# EasyEDA Pro project IronBen_扩展板.epro

# Schematic Schematic3
Board Name: 三代; Create Date: 2025-01-12; Page Name: P1; Project Name: 笨笨; Schematic Name: Schematic3; Update Date: 2025-06-20; Company: 嘉立创EDA; Page Size: A4; Version: V1.0
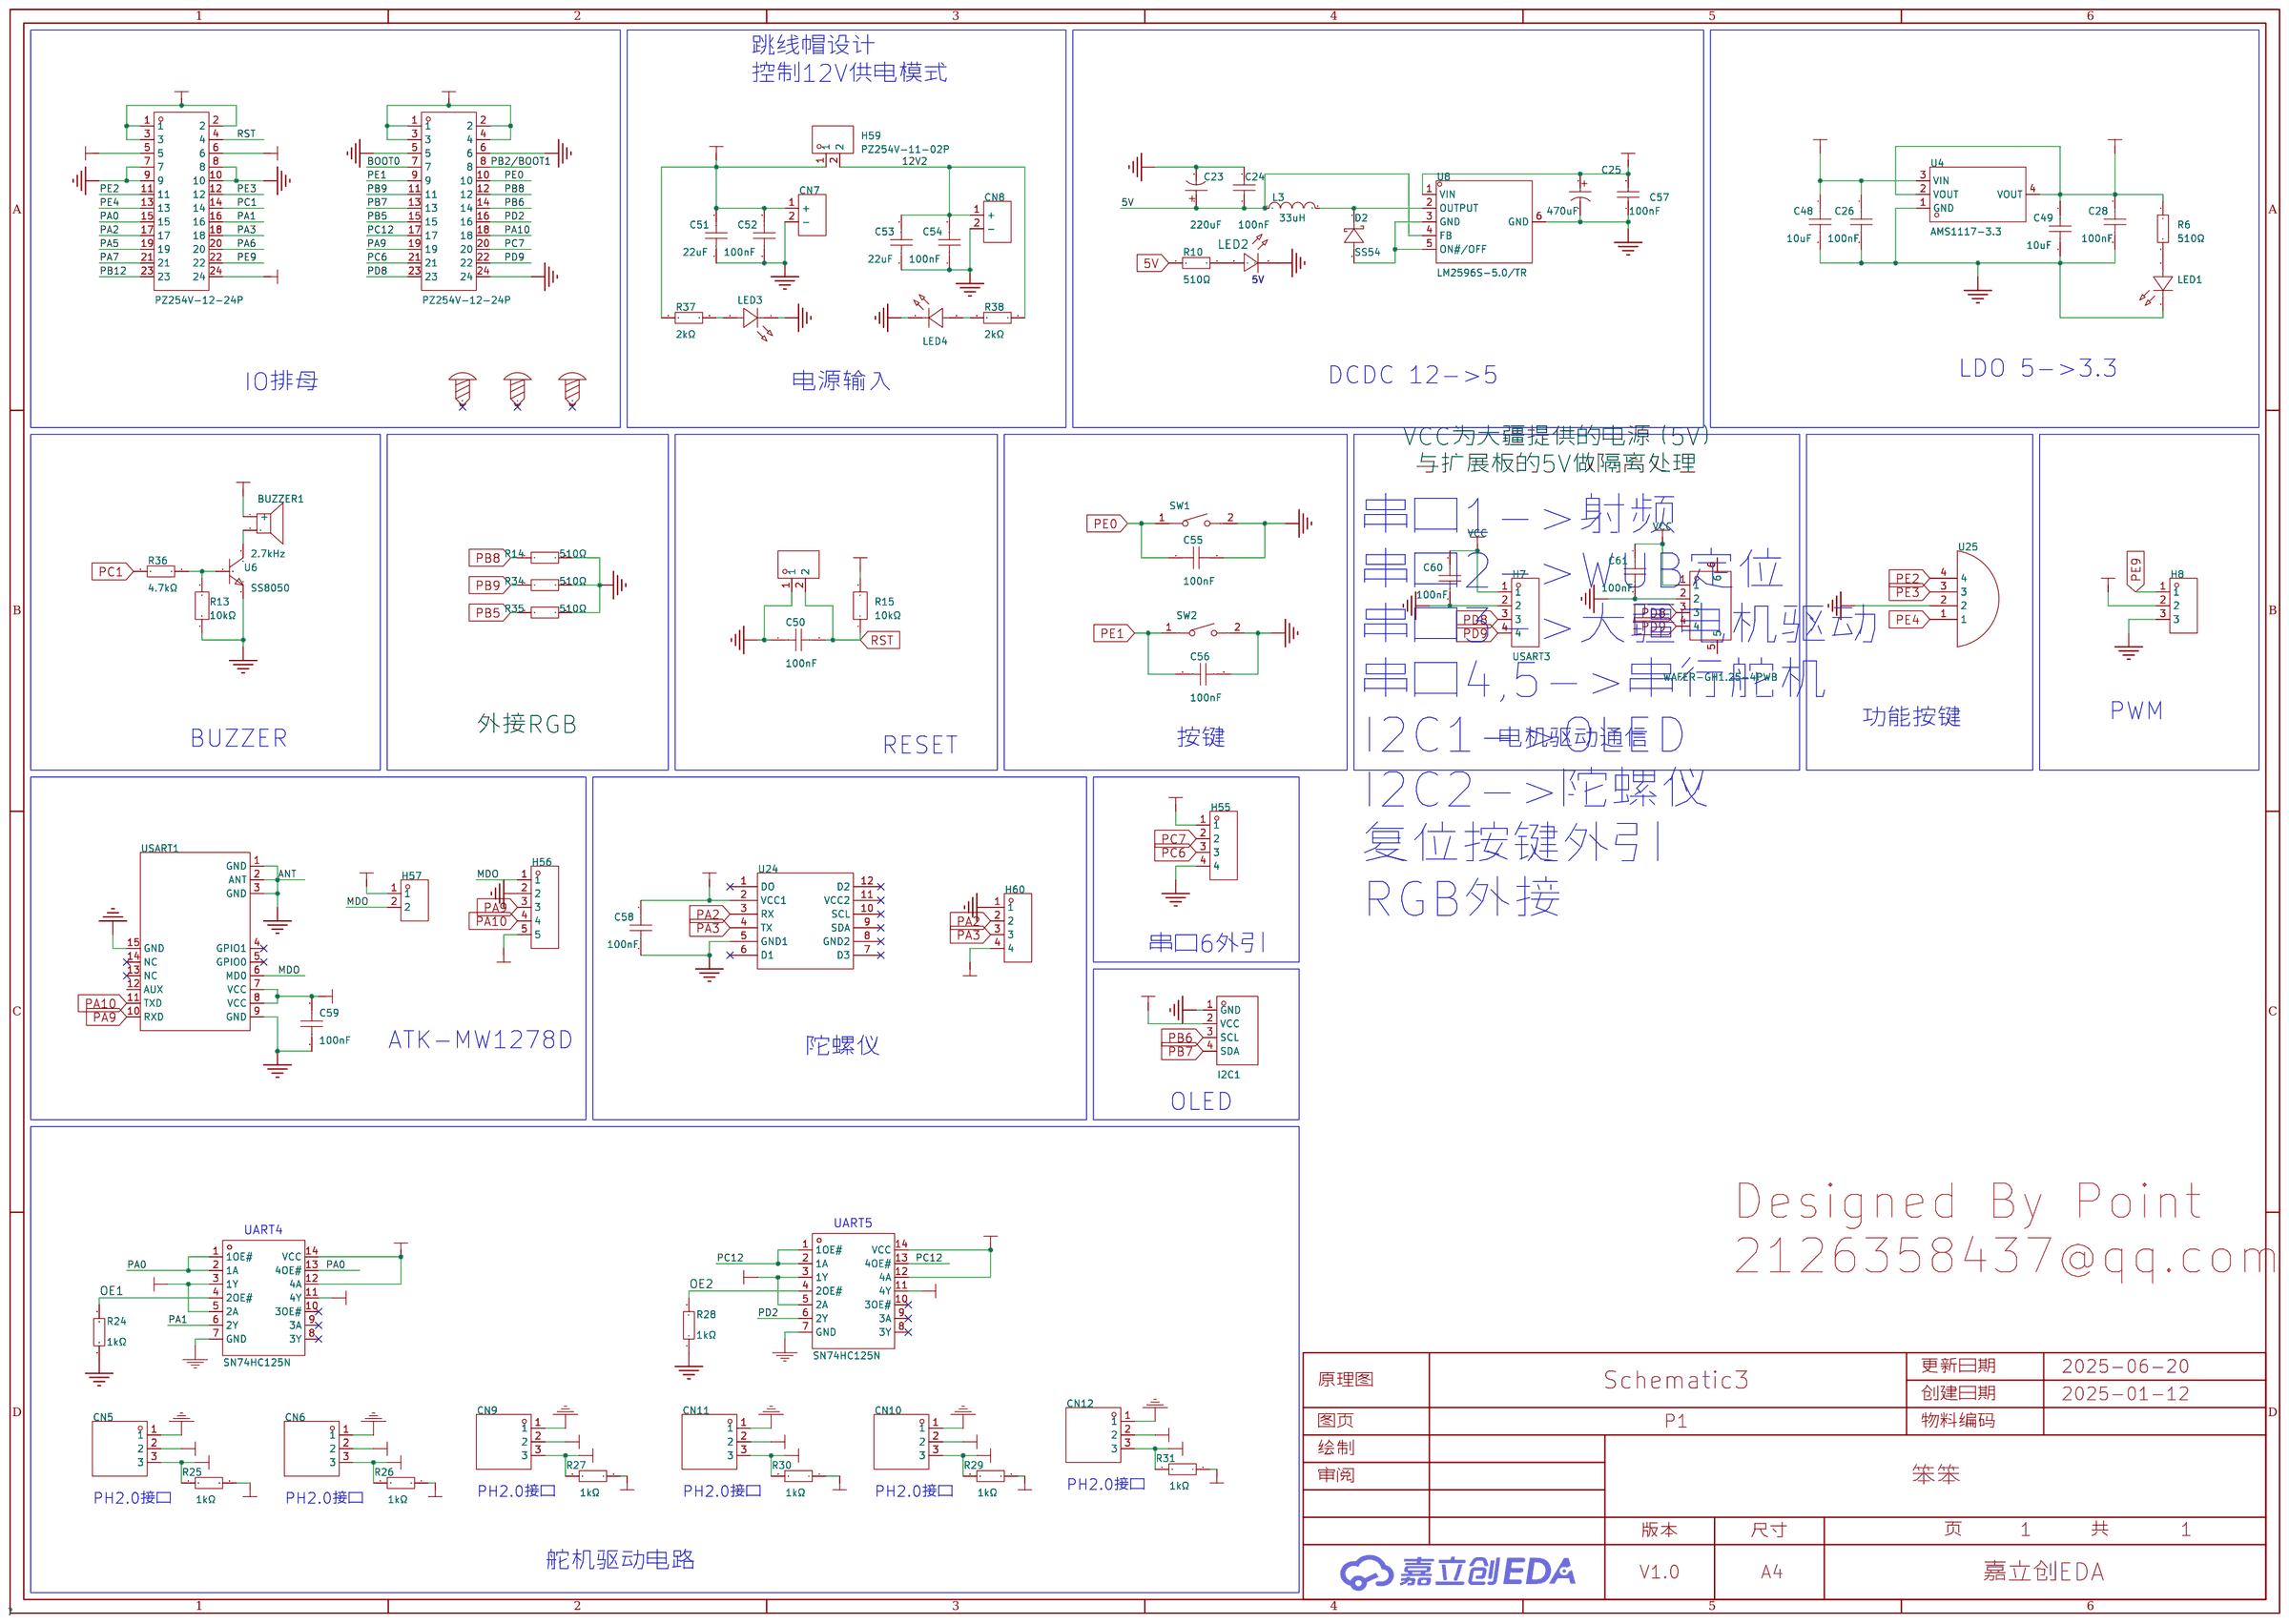
[diagram p0: schematic sheet]

## Parts
BUZZER1  2.7kHz  [BUZ-TH_BD12.0-P7.60-D0.6-FD]
C23  220uF  [CAP-SMD_BD6.3-L6.6-W6.6-FD]
C24  100nF  [C0805]
C25  470uF  [CAP-SMD_BD8.0-L8.3-W8.3-FD]
C26  100nF  [C0603]
C28  100nF  [C0603]
C48  10uF  [C0603]
C49  10uF  [C0603]
C50  100nF  [C0603]
C51  22uF  [C0603]
C52  100nF  [C0603]
C53  22uF  [C0603]
C54  100nF  [C0603]
C55  100nF  [C0603]
C56  100nF  [C0603]
C57  100nF  [C0805]
C58  100nF  [C0603]
C59  100nF  [C0603]
C60  100nF  [C0603]
C61  100nF  [C0603]
CN5  B03B-PASK-1(LF)(SN)  [conn-th_b03b-pask-1-lf-sn-1]
CN6  B03B-PASK-1(LF)(SN)  [conn-th_b03b-pask-1-lf-sn-1]
CN7  XT30UPB-F30.G.Y  [CONN-TH_XT30UPB-F]
CN8  XT30UPB-F30.G.Y  [CONN-TH_XT30UPB-F]
CN9  B03B-PASK-1(LF)(SN)  [conn-th_b03b-pask-1-lf-sn-1]
CN10  B03B-PASK-1(LF)(SN)  [conn-th_b03b-pask-1-lf-sn-1]
CN11  B03B-PASK-1(LF)(SN)  [conn-th_b03b-pask-1-lf-sn-1]
CN12  B03B-PASK-1(LF)(SN)  [conn-th_b03b-pask-1-lf-sn-1]
D2  SS54  [SMA_L4.3-W2.6-LS5.0-RD]
H6  PZ254V-12-24P  [HDR-TH_24P-P2.54-V-M-R2-C12-S2.54]
H7  USART3  [HDR-TH_4P-P2.54-V-M]
H8  PZ254V-11-03P  [HDR-TH_3P-P2.54-V-M]
H55  HC-PZ254-11.5L-1x4PZ  [HDR-TH_4P-P2.54-V-M]
H56  KH-2.54PH180-1X5P-L11.5  [HDR-TH_5P-P2.54-V-M]
H57  PZ254V-11-02P  [HDR-TH_2P-P2.54-V-M]
H58  PZ254V-12-24P  [HDR-TH_24P-P2.54-V-M-R2-C12-S2.54]
H59  PZ254V-11-02P  [HDR-TH_2P-P2.54-V-M]
H60  PZ254V-11-04P  [HDR-TH_4P-P2.54-V-M]
H62  HC-PZ254-13.8L-1x2PWA  [HDR-TH_2P-P2.54-V-M-1]
L3  33uH  [IND-SMD_L12.0-W12.0]
LED1  XL-1608SURC-06  [LED0603-RD_RED]
LED2  -  [LED_0603]
LED3  XL-1608SURC-06  [LED0603-RD_RED]
LED4  XL-1608SURC-06  [LED0603-RD_RED]
R6  510Ω  [R0603]
R10  510Ω  [R0603]
R13  10kΩ  [R0603]
R14  510Ω  [R0603]
R15  10kΩ  [R0603]
R24  1kΩ  [R0603]
R25  1kΩ  [R0603]
R26  1kΩ  [R0603]
R27  1kΩ  [R0603]
R28  1kΩ  [R0603]
R29  1kΩ  [R0603]
R30  1kΩ  [R0603]
R31  1kΩ  [R0603]
R34  510Ω  [R0603]
R35  510Ω  [R0603]
R36  4.7kΩ  [R0603]
R37  2kΩ  [R0603]
R38  2kΩ  [R0603]
SCREW1  -  [M3螺丝]
SCREW3  -  [M3螺丝]
SCREW4  -  [M3螺丝]
SW1  TS-1088-AR02016  [SW-SMD_L3.9-W3.0-P4.45]
SW2  TS-1088-AR02016  [SW-SMD_L3.9-W3.0-P4.45]
U4  AMS1117-3.3  [SOT-223-3_L6.5-W3.4-P2.30-LS7.0-BR]
U6  SS8050  [SOT-23-3_L2.9-W1.3-P1.90-LS2.4-BR]
U8  LM2596S-5.0/TR  [TO-263-5_L10.2-W8.6-P1.70-LS14.4-TL]
U19  SN74HC125N  [PDIP-14_L19.3-W6.4-P2.54-LS7.6-BL]
U20  I2C1  [OLED-TH_L27.8-W27.2-P2.54_C9900033791]
U21  SN74HC125N  [PDIP-14_L19.3-W6.4-P2.54-LS7.6-BL]
U24  -  [JY901s]
U25  -  [四PinU型按键]
U27  WAFER-GH1.25-4PWB  [CONN-SMD_4P-P1.25_XUNPU_WAFER-GH1.25-4PWB]
USART1  -  [atk-lora]

## Library data of the parts
BUZZER1 = TMB12A05_C96093: 驱动方式:有源(内含驱动线路);构造类型:电磁式;频率:2.7kHz;声压(SPL):85dB;; LCSC Part Name: TMB12A05; Supplier Part: C96093; Manufacturer: 华能; Manufacturer Part: TMB12A05; Supplier Footprint: 插件,D=12mm; JLCPCB Part Class: 扩展库; Datasheet: https://atta.szlcsc.com/upload/public/pdf/source/20230426/A4FC10532558AA232D532AB83455FBA4.pdf; Supplier: LCSC; Oscillator Circuit: 有源(内含驱动线路); Technology Type: 电磁式; Operating Voltage: 4V~8V; Sound Pressure Level (SPL): 85dB; Diameter (φD): 12mm; Height: 9.8mm
C23 = VT1C221M0607: 容值:220uF;精度:±20%;额定电压:16V;纹波电流:110mA@120Hz;等效串联电阻:-;; LCSC Part Name: 220uF ±20% 16V; Supplier Part: C90274; Manufacturer: ROQANG(容强); Supplier Footprint: SMD,D6.3xL7.7mm; JLCPCB Part Class: Extended Part; Datasheet: https://atta.szlcsc.com/upload/public/pdf/source/20161207/1481104186053.pdf; Supplier: LCSC; Tolerance: ±20%; Rated Voltage: 16V; Ripple Current: 110mA@120Hz; φD: 6.3mm; L: 7.7mm; Lifetime @ Temp: 2000hrs@105℃; Operating Temperature: -40℃~+105℃
C24 C57 = CL21B104KBCNNNC: 容值:100nF;精度:±10%;额定电压:50V;材质(温度系数):X7R;; LCSC Part Name: 100nF ±10% 50V; Supplier Part: C1711; Manufacturer: SAMSUNG(三星); Supplier Footprint: 0805; JLCPCB Part Class: Extended Part; Datasheet: https://atta.szlcsc.com/upload/public/pdf/source/20160218/1457707763339.pdf; Supplier: LCSC; Tolerance: ±10%; Voltage Rated: 50V; Temperature Coefficient: X7R
C25 = RVE1C471M0810_C107396: 容值:470uF;精度:±20%;额定电压:16V;纹波电流:450mA@120Hz;等效串联电阻:430mΩ;; LCSC Part Name: 470uF ±20% 16V; Supplier Part: C107396; Manufacturer: ROQANG(容强); Manufacturer Part: RVE1C471M0810; Supplier Footprint: SMD,D8xL10.2mm; JLCPCB Part Class: Extended Part; Datasheet: https://atta.szlcsc.com/upload/public/pdf/source/20180326/C107396_C6FCF70791E640AE09F0B90B652FE7BA.pdf; Supplier: LCSC; Tolerance: ±20%; Rated Voltage: 16V; Ripple Current: 450mA@120Hz; Equivalent Series Resistance(ESR): 430mΩ; φD: 8mm; L: 10.2mm; Lifetime @ Temp: 2000hrs@105℃; Operating Temperature: -55℃~+105℃
C26 C28 C55 C56 C58-C61 = CC0603KRX7R9BB104: 容值:100nF;精度:±10%;额定电压:50V;材质(温度系数):X7R;; LCSC Part Name: 100nF ±10% 50V; Supplier Part: C14663; Manufacturer: YAGEO(国巨); Supplier Footprint: 0603; JLCPCB Part Class: 基础库; Datasheet: https://atta.szlcsc.com/upload/public/pdf/source/20180910/C282072_33301C7F631E79921B82A8DAC6BCC5B3.pdf; Supplier: LCSC; Tolerance: ±10%; Voltage Rated: 50V; Temperature Coefficient: X7R
C48 C49 = CL10A106MA8NRNC: 容值:10uF;精度:±20%;额定电压:25V;材质(温度系数):X5R;; LCSC Part Name: 10uF ±20% 25V; Supplier Part: C96446; Manufacturer: SAMSUNG(三星); Supplier Footprint: 0603; JLCPCB Part Class: 基础库; Datasheet: https://atta.szlcsc.com/upload/public/pdf/source/20160218/1457707763339.pdf; Supplier: LCSC; Tolerance: ±20%; Voltage Rated: 25V; Temperature Coefficient: X5R
C50 C52 C54 = CGA0603X7R104K500JT: 容值:100nF;精度:±10%;额定电压:50V;材质(温度系数):X7R;; LCSC Part Name: 100nF ±10% 50V; Supplier Part: C6119867; Manufacturer: HRE(芯声); Supplier Footprint: 0603; JLCPCB Part Class: 扩展库; Supplier: LCSC; Tolerance: ±10%; Voltage Rated: 50V; Temperature Coefficient: X7R
C51 C53 = CGA0603X5R226M160JT: 容值:22uF;精度:±20%;额定电压:16V;材质(温度系数):X5R;; LCSC Part Name: 22uF ±20% 16V; Supplier Part: C6119868; Manufacturer: HRE(芯声); Supplier Footprint: 0603; JLCPCB Part Class: 扩展库; Supplier: LCSC; Tolerance: ±20%; Voltage Rated: 16V; Temperature Coefficient: X5R
CN5 CN6 CN9-CN12 = B03B-PASK-1(LF)(SN): 插针结构:1x3P;间距:2mm;安装方式:直插;参考系列:PA;总PIN数:3P;排数:1;每排PIN数:3;行距:-;额定电流:3A;触头材质:铜合金;触头镀层:锡;工作温度范围:-25℃~+85℃;; LCSC Part Name: 1x3P 间距:2mm 直插 系列:PA; Supplier Part: C160286; Manufacturer: JST; Supplier Footprint: 插件,P=2mm; JLCPCB Part Class: 扩展库; Datasheet: https://atta.szlcsc.com/upload/public/pdf/source/20181010/C265381_3D09E8EDBF5E2CA99C28909F72BE4C43.pdf; Supplier: LCSC; Pins Structure: 1x3P; Pitch: 2mm; Mounting Style: 直插; Reference Series: PA; Number of Pins: 3P; Number of Rows: 1; Number of PINs Per Row: 3; Current Rating (Max): 3A; Contact Material: 铜合金; Contact Plating: 锡; Operating Temperature Range: -25℃~+85℃
CN7 CN8 = XT30UPB-F30.G.Y: 类别:-;类型1:-;; LCSC Part Name: AMASS(艾迈斯)直立焊板式连接器XT30UPB30-F.G.*; Supplier Part: C108769; Manufacturer: AMASS(艾迈斯); JLCPCB Part Class: 扩展库; Datasheet: https://atta.szlcsc.com/upload/public/pdf/source/20220715/AFD68B9E8B6CA95A7295DBF4AF9325E4.pdf; Supplier: LCSC; Brand: 艾迈斯; Type: 航模插头; Colour: 黄色; RatedVoltage: DC 500V; InterfaceType: 母头; MetalMaterial: 镀金; InsulationMaterial: PA; RatedCurrent: 15A; contact resistance: 0.65mΩ
D2 = SS54_C727065: 二极管配置:独立式;正向压降(Vf):550mV@5A;直流反向耐压(Vr):40V;平均整流电流(Io):5A;; LCSC Part Name: 电压:40V 电流:5A; Supplier Part: C727065; Manufacturer: TWGMC(台湾迪嘉); Supplier Footprint: SMA(DO-214AC); JLCPCB Part Class: 扩展库; Datasheet: https://atta.szlcsc.com/upload/public/pdf/source/20200828/C727064_BD0A2B36CBC76CEA4B6710C57718D41F.pdf; Supplier: LCSC; Diode Configuration: 独立式; Forward Voltage (Vf@If): 550mV@5A; Reverse Voltage (Vr): 40V; Average Rectified Current (Io): 5A; Reverse Leakage Current (Ir): 500uA@40V
H6 H58 = PZ254V-12-24P: 插针结构:2x12P;间距:2.54mm;行距:2.54mm;圆针/方针:方针;安装类型:直插;排数:双排;总PIN位数:24P;额定电流:-;额定电压:-;配合针长度:6mm;塑高:2.5mm;端接针长度:3mm;触头材质:黄铜;触头镀层:-;工作温度范围:-40℃~+105℃;颜色:黑色;; LCSC Part Name: 间距:2.54mm 2x12P 直插 方针; Supplier Part: C492429; Manufacturer: XFCN(兴飞); Supplier Footprint: 插件,P=2.54mm; JLCPCB Part Class: 扩展库; Datasheet: https://atta.szlcsc.com/upload/public/pdf/source/20200309/C492429_A90DEF30FD4D9CDC2C3DDFC5EAF9C00B.pdf; Supplier: LCSC; Pin Structure: 2x12P; Pitch: 2.54mm; Row Spacing: 2.54mm; Circluar Pins/Square Pins: 方针; Mounting Type: 直插; Number of Rows: 双排; Number of Pins: 24P; Length of Mating Pin: 6mm; Insulation Height: 2.5mm; Length of End Connection Pin: 3mm; Contact Material: 黄铜; Operating Temperature Range: -40℃~+105℃; Color: 黑色
H7 H60 = PZ254V-11-04P: 插针结构:1x4P;间距:2.54mm;行距:-;圆针/方针:方针;安装类型:直插;排数:单排;总PIN位数:4P;额定电流:3A;额定电压:250V;配合针长度:6mm;塑高:2.5mm;端接针长度:3mm;触头材质:-;工作温度范围:-40℃~+105℃;颜色:黑色;; LCSC Part Name: 间距:2.54mm 1x4P 直插 方针; Supplier Part: C2691448; Manufacturer: XFCN(兴飞); Supplier Footprint: 插件,P=2.54mm; JLCPCB Part Class: 扩展库; Datasheet: https://atta.szlcsc.com/upload/public/pdf/source/20200309/C492403_F9F19131791D08044AD4F84F8E751A34.pdf; Supplier: LCSC; Pin Structure: 1x4P; Pitch: 2.54mm; Circluar Pins/Square Pins: 方针; Mounting Type: 直插; Number of Rows: 单排; Number of Pins: 4P; Current Rating (Max): 3A; Voltage Rating (Max): 250V; Length of Mating Pin: 6mm; Insulation Height: 2.5mm; Length of End Connection Pin: 3mm; Operating Temperature Range: -40℃~+105℃; Color: 黑色
H8 = PZ254V-11-03P: 插针结构:1x3P;间距:2.54mm;行距:-;圆针/方针:方针;安装类型:直插;排数:单排;总PIN位数:3P;额定电流:3A;额定电压:250V;配合针长度:6mm;塑高:2.5mm;端接针长度:3mm;工作温度范围:-40℃~+105℃;颜色:黑色;; LCSC Part Name: 间距:2.54mm 1x3P 直插 方针; Supplier Part: C2937625; Manufacturer: XFCN(兴飞); Supplier Footprint: 插件,P=2.54mm; JLCPCB Part Class: 扩展库; Datasheet: https://atta.szlcsc.com/upload/public/pdf/source/20200309/C492402_8335C3D49C4E4C618838D59BB1D024C1.pdf; Supplier: LCSC; Pin Structure: 1x3P; Pitch: 2.54mm; Circluar Pins/Square Pins: 方针; Mounting Type: 直插; Number of Rows: 单排; Number of Pins: 3P; Current Rating (Max): 3A; Voltage Rating (Max): 250V; Length of Mating Pin: 6mm; Insulation Height: 2.5mm; Length of End Connection Pin: 3mm; Operating Temperature Range: -40℃~+105℃; Color: 黑色
H55 = HC-PZ254-11.5L-1x4PZ: 插针结构:1x4P;间距:2.54mm;行距:-;圆针/方针:方针;安装类型:直插;排数:单排;总PIN位数:4P;额定电流:3A;配合针长度:6mm;塑高:2.5mm;端接针长度:3mm;触头材质:黄铜;触头镀层:金;工作温度范围:-40℃~+105℃;焊接温度(最大值):260℃;颜色:黑色;; LCSC Part Name: 间距2.54mm 1x4Pin 直插 H2.5 L11.5; Supplier Part: C27985189; Manufacturer: HC(虹成电子); Supplier Footprint: 插件,P=2.54mm; JLCPCB Part Class: 扩展库; Datasheet: https://atta.szlcsc.com/upload/public/pdf/source/20240710/CB85400293F297620DD48460C85CEAB6.pdf; Supplier: LCSC; Pin Structure: 1x4P; Pitch: 2.54mm; Circluar Pins/Square Pins: 方针; Mounting Type: 直插; Number of Rows: 单排; Number of Pins: 4P; Current Rating (Max): 3A; Length of Mating Pin: 6mm; Insulation Height: 2.5mm; Length of End Connection Pin: 3mm; Contact Material: 黄铜; Contact Plating: 金; Operating Temperature Range: -40℃~+105℃; Soldering Temperature(Max): 260℃; Color: 黑色
H56 = KH-2.54PH180-1X5P-L11.5: 插针结构:1x5P;间距:2.54mm;行距:-;圆针/方针:方针;安装类型:直插;排数:单排;总PIN位数:5P;额定电流:3A;额定电压:-;配合针长度:6mm;塑高:2.5mm;端接针长度:3mm;工作温度范围:-40℃~+105℃;颜色:黑色;; LCSC Part Name: 间距:2.54mm 1x5P 直插 方针; Supplier Part: C2932699; Manufacturer: kinghelm(金航标); Supplier Footprint: 插件,P=2.54mm; JLCPCB Part Class: 扩展库; Datasheet: https://atta.szlcsc.com/upload/public/pdf/source/20211220/226CF9663F50C56A6910C5061F0E2217.pdf; Supplier: LCSC; Pin Structure: 1x5P; Pitch: 2.54mm; Circluar Pins/Square Pins: 方针; Mounting Type: 直插; Number of Rows: 单排; Number of Pins: 5P; Current Rating (Max): 3A; Length of Mating Pin: 6mm; Insulation Height: 2.5mm; Length of End Connection Pin: 3mm; Operating Temperature Range: -40℃~+105℃; Color: 黑色
H57 H59 = PZ254V-11-02P: 插针结构:1x2P;间距:2.54mm;行距:-;圆针/方针:方针;安装类型:直插;排数:单排;总PIN位数:2P;额定电流:-;额定电压:-;配合针长度:6mm;塑高:2.5mm;端接针长度:3mm;触头材质:黄铜;触头镀层:-;工作温度范围:-40℃~+105℃;颜色:黑色;; LCSC Part Name: 间距:2.54mm 1x2P 直插 方针; Supplier Part: C492401; Manufacturer: XFCN(兴飞); Supplier Footprint: 插件,P=2.54mm; JLCPCB Part Class: 扩展库; Datasheet: https://atta.szlcsc.com/upload/public/pdf/source/20200309/C492401_A812433581A9B211A7FFA413ADDFF0E5.pdf; Supplier: LCSC; Pin Structure: 1x2P; Pitch: 2.54mm; Circluar Pins/Square Pins: 方针; Mounting Type: 直插; Number of Rows: 单排; Number of Pins: 2P; Length of Mating Pin: 6mm; Insulation Height: 2.5mm; Length of End Connection Pin: 3mm; Contact Material: 黄铜; Operating Temperature Range: -40℃~+105℃; Color: 黑色
H62 = HC-PZ254-13.8L-1x2PWA: 插针结构:1x2P;间距:2.54mm;行距:-;圆针/方针:方针;排数:单排;总PIN位数:2P;额定电流:3A;额定电压:-;配合针长度:6mm;塑高:2.5mm;端接针长度:3mm;触头材质:黄铜;触头镀层:金;工作温度:-40℃~+105℃;颜色:黑色;; LCSC Part Name: 间距2.54mm 1x2Pin 弯插 PC3.0 PA6.0 PB4.3 L13.8 弯凹面; Supplier Part: C27985201; Manufacturer: HC(虹成电子); Supplier Footprint: 弯插,P=2.54mm; JLCPCB Part Class: 扩展库; Datasheet: https://atta.szlcsc.com/upload/public/pdf/source/20250106/2CC12058963FF98249E2E6FA65E04B96.pdf; Supplier: LCSC; Pin Structure: 1x2P; Pitch: 2.54mm; Circluar Pins/Square Pins: 方针; Number of Rows: 单排; Number of Pins: 2P; Current Rating: 3A; Length of Mating Pin: 6mm; Insulation Height: 2.5mm; Length of End Connection Pin: 3mm; Contact Material: 黄铜; Contact Plating: 金; Operating Temperature: -40℃~+105℃; Color: 黑色
L3 = SLH1207S330MTT: 电感值:33uH;精度:±20%;额定电流:3A;; LCSC Part Name: 33uH ±20%; Supplier Part: C181844; Manufacturer: Sunltech(韩国顺磁); Supplier Footprint: SMD; JLCPCB Part Class: Extended Part; Datasheet: https://atta.szlcsc.com/upload/public/pdf/source/20180509/C216200_948378E1D3CCC25B70CFE5927CB2C576.pdf; Supplier: LCSC; Tolerance: ±20%; Rated Current: 3A; DC Resistance (DCR): 64.8mΩ
LED1 LED3 LED4 = XL-1608SURC-06: 发光颜色:红色;功率:55mW;正向电流:25mA;主波长:617nm~621nm;透镜颜色:无色透明透镜;色温:-;发光角度:120°;载带方式:正贴;工作温度:-30℃~+85℃;; Supplier Part: C965799; Manufacturer: XINGLIGHT(成兴光); Supplier Footprint: 0603; JLCPCB Part Class: 扩展库; Datasheet: https://atta.szlcsc.com/upload/public/pdf/source/20221102/D860AFDD1CDB02C5A8064103A32707E2.pdf; Supplier: LCSC; Emitted Color: 红色; Power Dissipation: 55mW; Forward Current: 25mA; Dominant Wavelength: 617nm~621nm; Peak Wavelength: 623nm; Lens Color: 无色透明透镜; Viewing Angle: 120°; Mounting Sytle: 正贴; Operating Temperature: -30℃~+85℃
LED2 = LED_0603-R: 5V; Supplier Footprint: 0603
R6 R10 R14 R34 R35 = 0603WAF5100T5E: 电阻类型:厚膜电阻;阻值:510Ω;精度:±1%;功率:100mW;最大工作电压:75V;温度系数:±100ppm/℃;; LCSC Part Name: 510Ω ±1% 100mW 厚膜电阻; Supplier Part: C23193; Manufacturer: UNI-ROYAL(厚声); Supplier Footprint: 0603; JLCPCB Part Class: 基础库; Datasheet: https://atta.szlcsc.com/upload/public/pdf/source/20200306/C422600_1E6D84923E4A46A82E41ADD87F860B5C.pdf; Supplier: LCSC; Type: 厚膜电阻; Tolerance: ±1%; Power(Watts): 100mW; Overload Voltage (Max): 75V; Temperature Coefficient: ±100ppm/℃; Operating Temperature Range: -55℃~+155℃
R13 R15 = FRC0603J103TS: 电阻类型:厚膜电阻;阻值:10kΩ;精度:±5%;功率:100mW;最大工作电压:75V;温度系数:±100ppm/℃;; LCSC Part Name: 10kΩ ±5% 100mW 厚膜电阻; Supplier Part: C2930027; Manufacturer: FOJAN(富捷); Supplier Footprint: 0603; JLCPCB Part Class: 扩展库; Datasheet: https://atta.szlcsc.com/upload/public/pdf/source/20211221/925EC7D7225764EE0046F22065062C87.pdf; Supplier: LCSC; Type: 厚膜电阻; Tolerance: ±5%; Power(Watts): 100mW; Overload Voltage (Max): 75V; Temperature Coefficient: ±100ppm/℃; Operating Temperature Range: -55℃~+155℃
R24-R31 = RC0603FR-071KL: 电阻类型:厚膜电阻;阻值:1kΩ;精度:±1%;功率:100mW;最大工作电压:75V;温度系数:±100ppm/℃;; LCSC Part Name: 厚膜电阻 1kΩ ±1% 100mW; Supplier Part: C22548; Manufacturer: YAGEO(国巨); Supplier Footprint: 0603; JLCPCB Part Class: 扩展库; Datasheet: https://atta.szlcsc.com/upload/public/pdf/source/20180316/70C0E2BDAE7FCC62C531A5A58D202EE1.pdf; Supplier: LCSC; Type: 厚膜电阻; Tolerance: ±1%; Power(Watts): 100mW; Overload Voltage (Max): 75V; Temperature Coefficient: ±100ppm/℃; Operating Temperature Range: -55℃~+155℃
R36 = RC0603FR-074K7L: 电阻类型:厚膜电阻;阻值:4.7kΩ;精度:±1%;功率:100mW;最大工作电压:75V;温度系数:±100ppm/℃;; LCSC Part Name: 厚膜电阻 4.7kΩ ±1% 100mW; Supplier Part: C99782; Manufacturer: YAGEO(国巨); Supplier Footprint: 0603; JLCPCB Part Class: 扩展库; Datasheet: https://atta.szlcsc.com/upload/public/pdf/source/20180224/C181757_15194369480721363983.pdf; Supplier: LCSC; Type: 厚膜电阻; Tolerance: ±1%; Power(Watts): 100mW; Overload Voltage (Max): 75V; Temperature Coefficient: ±100ppm/℃; Operating Temperature Range: -55℃~+155℃
R37 R38 = 0603WAF2001T5E: 电阻类型:厚膜电阻;阻值:2kΩ;精度:±1%;功率:100mW;最大工作电压:75V;温度系数:±100ppm/℃;; LCSC Part Name: 2kΩ ±1% 100mW 厚膜电阻; Supplier Part: C22975; Manufacturer: UNI-ROYAL(厚声); Supplier Footprint: 0603; JLCPCB Part Class: 基础库; Datasheet: https://atta.szlcsc.com/upload/public/pdf/source/20200306/C422600_1E6D84923E4A46A82E41ADD87F860B5C.pdf; Supplier: LCSC; Type: 厚膜电阻; Tolerance: ±1%; Power(Watts): 100mW; Overload Voltage (Max): 75V; Temperature Coefficient: ±100ppm/℃; Operating Temperature Range: -55℃~+155℃
SCREW1 SCREW3 SCREW4 = M3螺丝: Supplier Footprint: 插件
SW1 SW2 = TS-1088-AR02016: 电路结构:单刀单掷;按钮形状:圆形按钮;作用力:160gf;安装方式:立贴;开关长度:4mm;开关宽度:3mm;开关高度:2mm;带支架:不带;触点电流:50mA;额定电压(DC):12V;绝缘电阻:100MΩ;机械寿命:10万次;; LCSC Part Name: 4*3*2mm 立贴 轻触开关; Supplier Part: C720477; Manufacturer: XUNPU(讯普); Supplier Footprint: SMD; JLCPCB Part Class: 扩展库; Datasheet: https://atta.szlcsc.com/upload/public/pdf/source/20200810/C720475_60D09DD6C54279ADDB2DC25100F1CC11.pdf; Supplier: LCSC; Circuit: 单刀单掷; Actuator Style: 圆形按钮; Operating Force: 160gf; Mounting Style: 立贴; Switch Length: 4mm; Switch Width: 3mm; Switch Height: 2mm; Strike Gundam: 不带; Contact Current: 50mA; Voltage Rating (DC): 12V; Insulation Resistance: 100MΩ; Actuator/Cap Color: 黑色; Pin Style: SMD接片; Mechanical Life: 10万次; Operating Temperature: -30℃~+80℃
U4 = AMS1117-3.3_C6186: 输出类型:固定;最大输入电压:-;输出电压:3.3V;最大输出电流:1A;电源纹波抑制比(PSRR):72dB@(120Hz);输出极性:正极;; LCSC Part Name: 输出3.3V 1A; Supplier Part: C6186; Manufacturer: AMS; Supplier Footprint: SOT-223; JLCPCB Part Class: 基础库; Datasheet: https://atta.szlcsc.com/upload/public/pdf/source/20180727/C6186_7A095716F0823C02F1997A905E26C086.pdf; Supplier: LCSC; Output Type: 固定; Output Voltage: 3.3V; MAX Output Current: 1A; Power Supply Rejection Ratio (PSRR): 72dB@(120Hz); Dropout Voltage: 1.3V@(800mA); Output Polarity: 正极; Number of Outputs: 1
U6 = SS8050_C7420370: 晶体管类型:NPN;集电极电流(Ic):1.5A;集射极击穿电压(Vceo):25V;功率(Pd):300mW;直流电流增益(hFE@Ic,Vce):120@100mA,1.0V;; LCSC Part Name: 耐压:25V 电流:1.5A NPN H档 200-350; Supplier Part: C7420370; Manufacturer: 宏迦橙; Supplier Footprint: SOT-23; JLCPCB Part Class: 扩展库; Datasheet: https://atta.szlcsc.com/upload/public/pdf/source/20231222/9C4050A7669EB24B3ACD0418218817FD.pdf; Supplier: LCSC; Transistor Type: NPN; Collector Current (Ic): 1.5A; Collector-Emitter Breakdown Voltage (Vceo): 25V; Power Dissipation (Pd): 300mW; DC Current Gain (hFE@Ic,Vce): 120@100mA,1.0V; Transition Frequency (fT): 100MHz; Collector Cut-Off Current (Icbo): 100nA; Collector-Emitter Saturation Voltage (VCE(sat)@Ic,Ib): 500mV@800mA,80mA; Operating Temperature: -55℃~+150℃
U8 = LM2596S-5.0/TR: Supplier Part: C194349; Manufacturer: HGSEMI(华冠); Supplier Footprint: TO-263-5; JLCPCB Part Class: Extended Part; Datasheet: https://atta.szlcsc.com/upload/public/pdf/source/20200924/C194349_32A49216D05BD4A6AA6EE8DE19C810A9.pdf; Supplier: LCSC
U19 U21 = SN74HC125N: 电源电压:2V~6V;元件数:4;每个元件位数:1;灌电流(IOL):7.8mA;拉电流(IOH):7.8mA;; Supplier Part: C2890; Manufacturer: TI(德州仪器); Supplier Footprint: DIP-14; JLCPCB Part Class: 扩展库; Datasheet: https://www.ti.com/cn/lit/gpn/sn74hc125; Supplier: LCSC; output type: 三态; Supply Voltage: 2V~6V; Number of Elements: 4; Number of Bits per Element: 1; Sink Current: 7.8mA; Source Current: 7.8mA; Logic Family: 74HC; Operating Temperature: -40℃~+85℃
U20 = HS96L03W2C03: 主控芯片:SSD1315;接口类型:I2C;尺寸(inch):0.96;像素分辨率:128x64;; LCSC Part Name: 0.96寸OLED显示屏窄白光IIC; Supplier Part: C5248080; Manufacturer: HS(汉昇); JLCPCB Part Class: 扩展库; Datasheet: https://atta.szlcsc.com/upload/public/pdf/source/20230627/763D01F79A90007632F098068C7C8AD9.pdf; Supplier: LCSC; Main Control Chip: SSD1315; Interface Type: I2C; Size: 0.96; Pixel Resolution: 128x64; Operating Temperature: -40℃~+70℃
U24 = JY901S
U25 = 四脚U型按键
U27 = WAFER-GH1.25-4PWB: 插针结构:1x4P;间距:1.25mm;安装方式:卧贴;参考系列:GH;总PIN数:4P;排数:1;每排PIN数:4;行距:-;额定电流:1A;触头材质:黄铜;触头镀层:-;工作温度范围:-25℃~+85℃;; LCSC Part Name: 1x4P 间距:1.25mm 卧贴 系列:GH; Supplier Part: C3029379; Manufacturer: XUNPU(讯普); Supplier Footprint: SMD,P=1.25mm,卧贴; JLCPCB Part Class: 扩展库; Datasheet: https://atta.szlcsc.com/upload/public/pdf/source/20220527/CB8773BFB0913C3B8ABD62CB38BA101A.pdf; Supplier: LCSC; Pins Structure: 1x4P; Pitch: 1.25mm; Mounting Type: 卧贴; Reference Series: GH; Number of Pins: 4P; Number of Rows: 1; Number of PINs Per Row: 4; Current Rating: 1A; Contact Material: 黄铜; Operating Temperature: -25℃~+85℃; Voltage Rating: 125V; Plastic Material: LCP; Supplementary Features: 辅助焊脚; Color: 米色; Z-Height of the Board: 4.35mm; X-Length of Bottom Edge on Board (Spacing Line): 8.25mm; Y-Width of Bottom Edge on Board: 5mm
USART1 = ATK-LORA-02: 正点原子LORA; _: 3

## Nets
3V3: C28.1 C49.1 H6.5 H6.6 H57.1 H58.1 H58.2 H58.3 H58.4 R6.1 R15.2 R25.1 R26.1 R27.1 R29.1 R30.1 R31.1 U4.2(VOUT) U4.4(VOUT) U19.12(4A) U19.14(VCC) U20.2(VCC) U21.12(4A) U21.14(VCC)
5V: BUZZER1.1(+) C23.1 C24.1 C26.1 C48.1 C58.1 C59.1 H6.1 H6.2 H6.3 H6.24 H8.2 H55.1 H56.5 H60.4 L3.1 R10.1 U4.3(VIN) U8.4(FB) U24.2(VCC1) USART1.7(VCC) USART1.8(VCC)
12V1: C25.1 C51.2 C52.2 C57.2 CN5.2 CN6.2 CN7.1(+) CN9.2 H59.1 R37.1 U8.1(VIN)
12V2: C53.2 C54.2 CN8.1(+) CN10.2 CN11.2 CN12.2 H59.2 R38.2
GND: C23.2 C24.2 C25.2 C26.2 C28.2 C48.2 C49.2 C50.1 C51.1 C52.1 C53.1 C54.1 C55.2 C56.2 C57.1 C58.2 C59.2 C60.2 C61.2 CN5.1 CN6.1 CN7.2(-) CN8.2(-) CN9.1 CN10.1 CN11.1 CN12.1 H6.7 H6.8 H6.9 H6.10 H7.2 H8.3 H55.4 H56.2 H58.5 H58.6 H58.24 H60.1 H62.1 LED1.1(K) LED2.1(C) LED3.1(K) LED4.1(K) R13.1 R14.2 R24.1 R28.1 R34.2 R35.2 SW1.2 SW2.2 U4.1(GND) U6.2(E) U8.6(GND) U19.7(GND) U20.1(GND) U21.7(GND) U24.5(GND1) U25.2 U27.2 USART1.1(GND) USART1.3(GND) USART1.9(GND) USART1.15(GND)
VCC: C60.1 C61.1 H7.1 U27.1
ANT: USART1.2(ANT)
BOOT0: H58.7
BUS1: CN5.3 CN6.3 CN9.3 R25.2 R26.2 R27.2 U19.3(1Y) U19.5(2A)
BUS2: CN10.3 CN11.3 CN12.3 R29.2 R30.2 R31.2 U21.3(1Y) U21.5(2A)
MDO: H56.1 H57.2 USART1.6(MD0)
OE1: R24.2 U19.4(2OE#) U19.11(4Y)
OE2: R28.2 U21.4(2OE#) U21.11(4Y)
PA0: H6.15 U19.1(1OE#) U19.2(1A) U19.13(4OE#)
PA1: H6.16 U19.6(2Y)
PA2: H6.17 H60.2 U24.3(RX)
PA3: H6.18 H60.3 U24.4(TX)
PA5: H6.19
PA6: H6.20
PA7: H6.21
PA9: H56.3 H58.19 USART1.10(RXD)
PA10: H56.4 H58.18 USART1.11(TXD)
PB2/BOOT1: H58.8
PB5: H58.15 R35.1
PB6: H58.14 U20.3(SCL)
PB7: H58.13 U20.4(SDA)
PB8: H58.12 R14.1
PB9: H58.11 R34.1
PB12: H6.23
PC1: H6.14 R36.1
PC6: H55.3 H58.21
PC7: H55.2 H58.20
PC12: H58.17 U21.1(1OE#) U21.2(1A) U21.13(4OE#)
PD2: H58.16 U21.6(2Y)
PD8: H7.3 H58.23 U27.3
PD9: H7.4 H58.22 U27.4
PE0: C55.1 H58.10 SW1.1
PE1: C56.1 H58.9 SW2.1
PE2: H6.11 U25.4
PE3: H6.12 U25.3
PE4: H6.13 U25.1
PE9: H6.22 H8.1
RST: C50.2 H6.4 H62.2 R15.1
$1N4130: LED1.2(A) R6.2
$1N4134: R13.2 R36.2 U6.1(B)
$1N4137: BUZZER1.2 U6.3(C)
$1N4153: LED3.2(A) R37.2
$1N4155: LED4.2(A) R38.1
$1N14491: D2.2 U8.3(GND) U8.5(ON#/OFF)
$1N14492: D2.1 L3.2 U8.2(OUTPUT)
$1N14499: LED2.2(A) R10.2

Not connected (* = marked no-connect by the designer): SCREW1 1*; SCREW3 1*; SCREW4 1*; U19 8(3Y)* 9(3A)* 10(3OE#)*; U21 8(3Y)* 9(3A)* 10(3OE#)*; U24 1(DO)* 6(D1)* 7(D3)* 8(GND2)* 9(SDA)* 10(SCL)* 11(VCC2)* 12(D2)*; U27 5 6; USART1 4(GPIO1)* 5(GPIO0)* 12(AUX) 13(NC)* 14(NC)*

## Notes on the sheet
- 跳线帽设计
  控制12V供电模式
- DCDC 12->5
- LDO 5->3.3
- IO排母
- 电源输入
- VCC为大疆提供的电源（5V）
   与扩展板的5V做隔离处理
- 功能按键
- PWM
- 外接RGB
- BUZZER
- RESET
- 按键
- 电机驱动通信
- 串口1->射频
  串口2->WUB定位
  串口3->大疆电机驱动
  串口4,5->串行舵机
  I2C1->OLED
  I2C2->陀螺仪
  复位按键外引
  RGB外接
- 串口6外引
- ATK-MW1278D
- 陀螺仪
- OLED
- UART5
- UART4
- Designed By Point
  2126358437@qq.com
- PH2.0接口
- PH2.0接口
- PH2.0接口
- PH2.0接口
- PH2.0接口
- PH2.0接口
- 舵机驱动电路

# Board PCB7
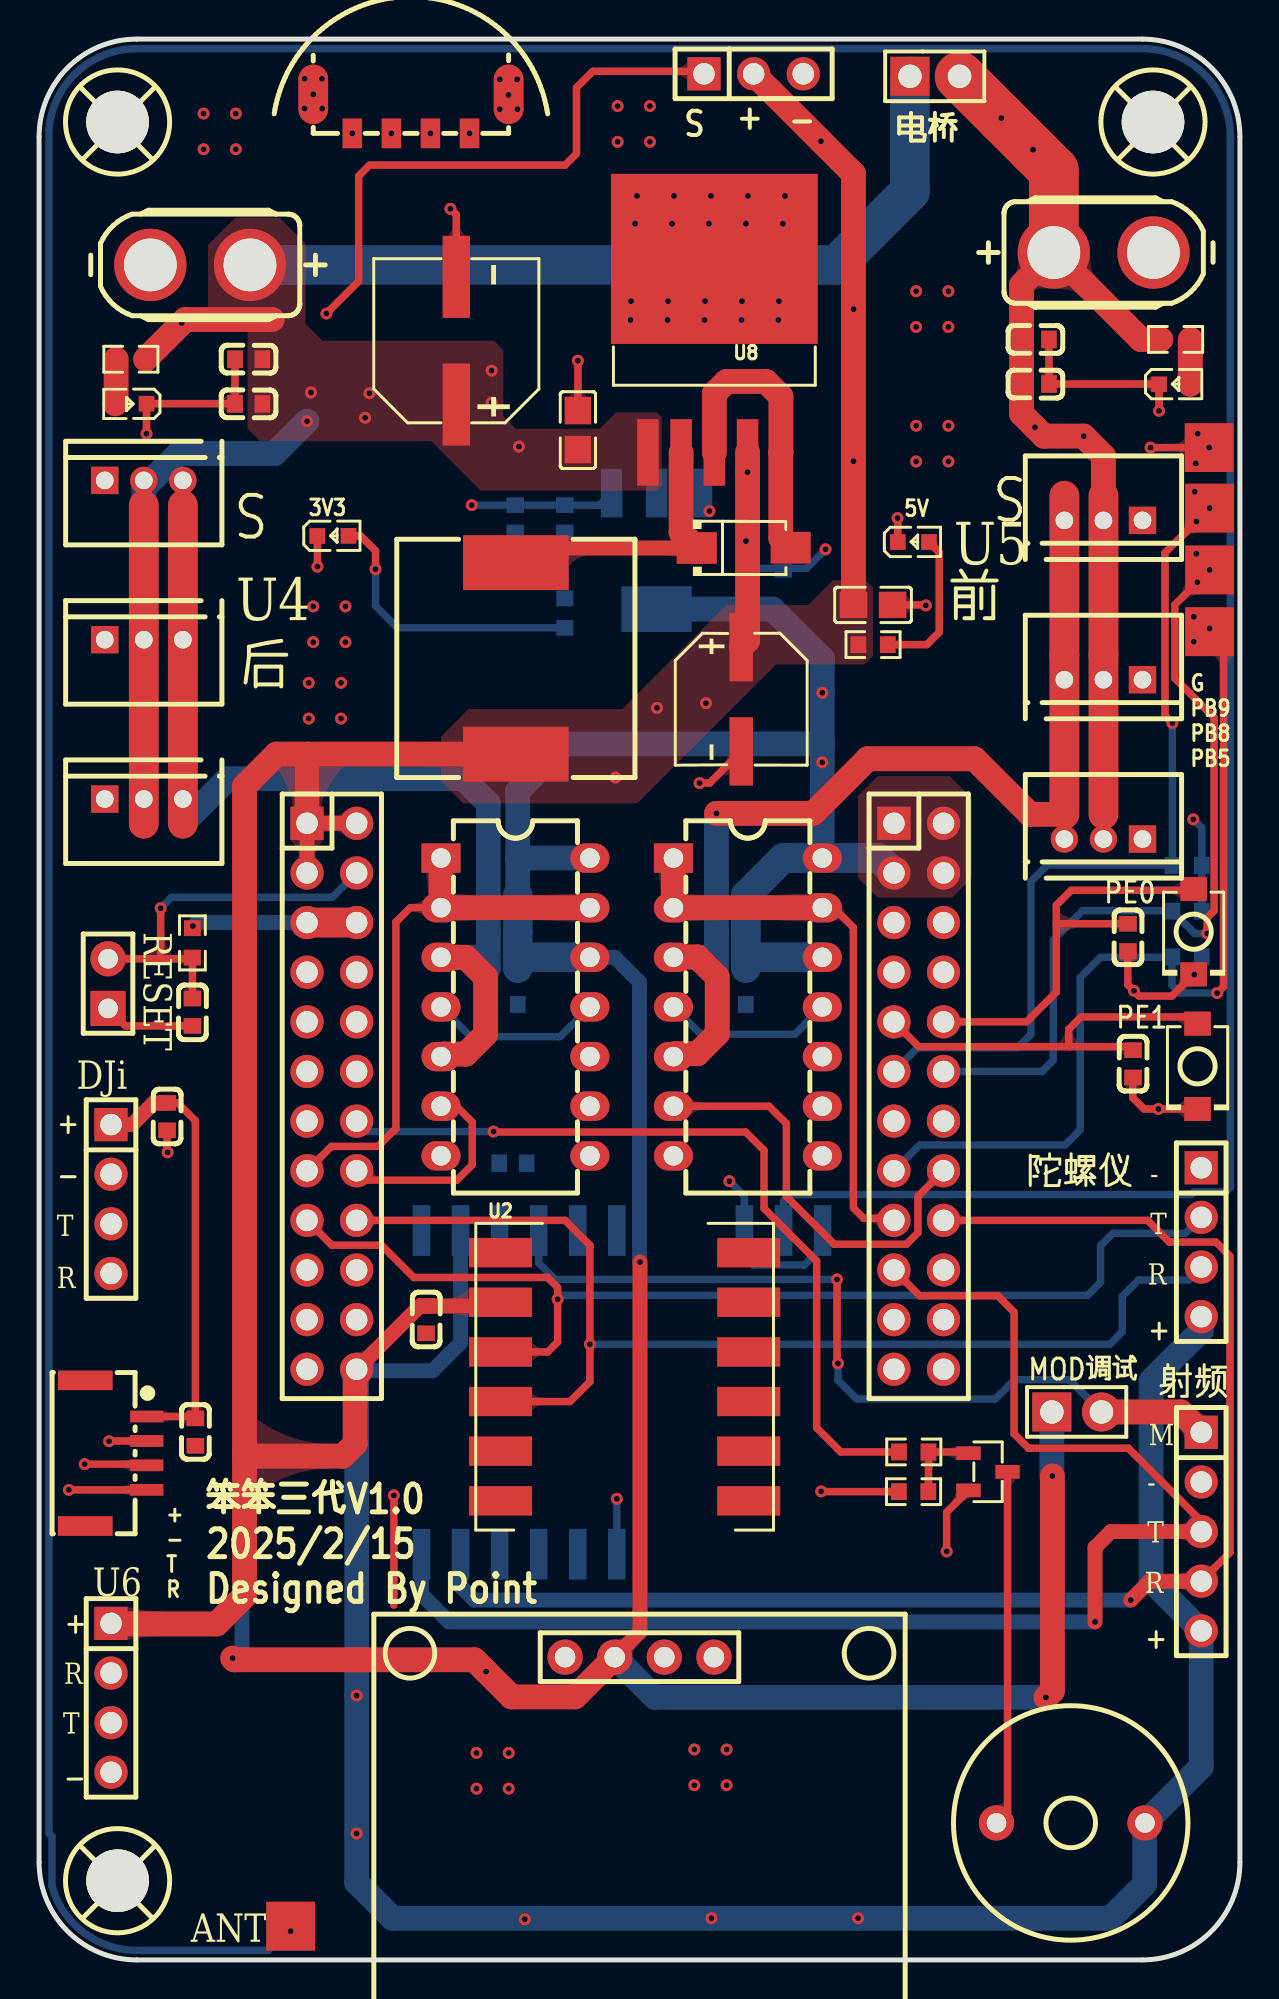
[diagram p1: board, top side]
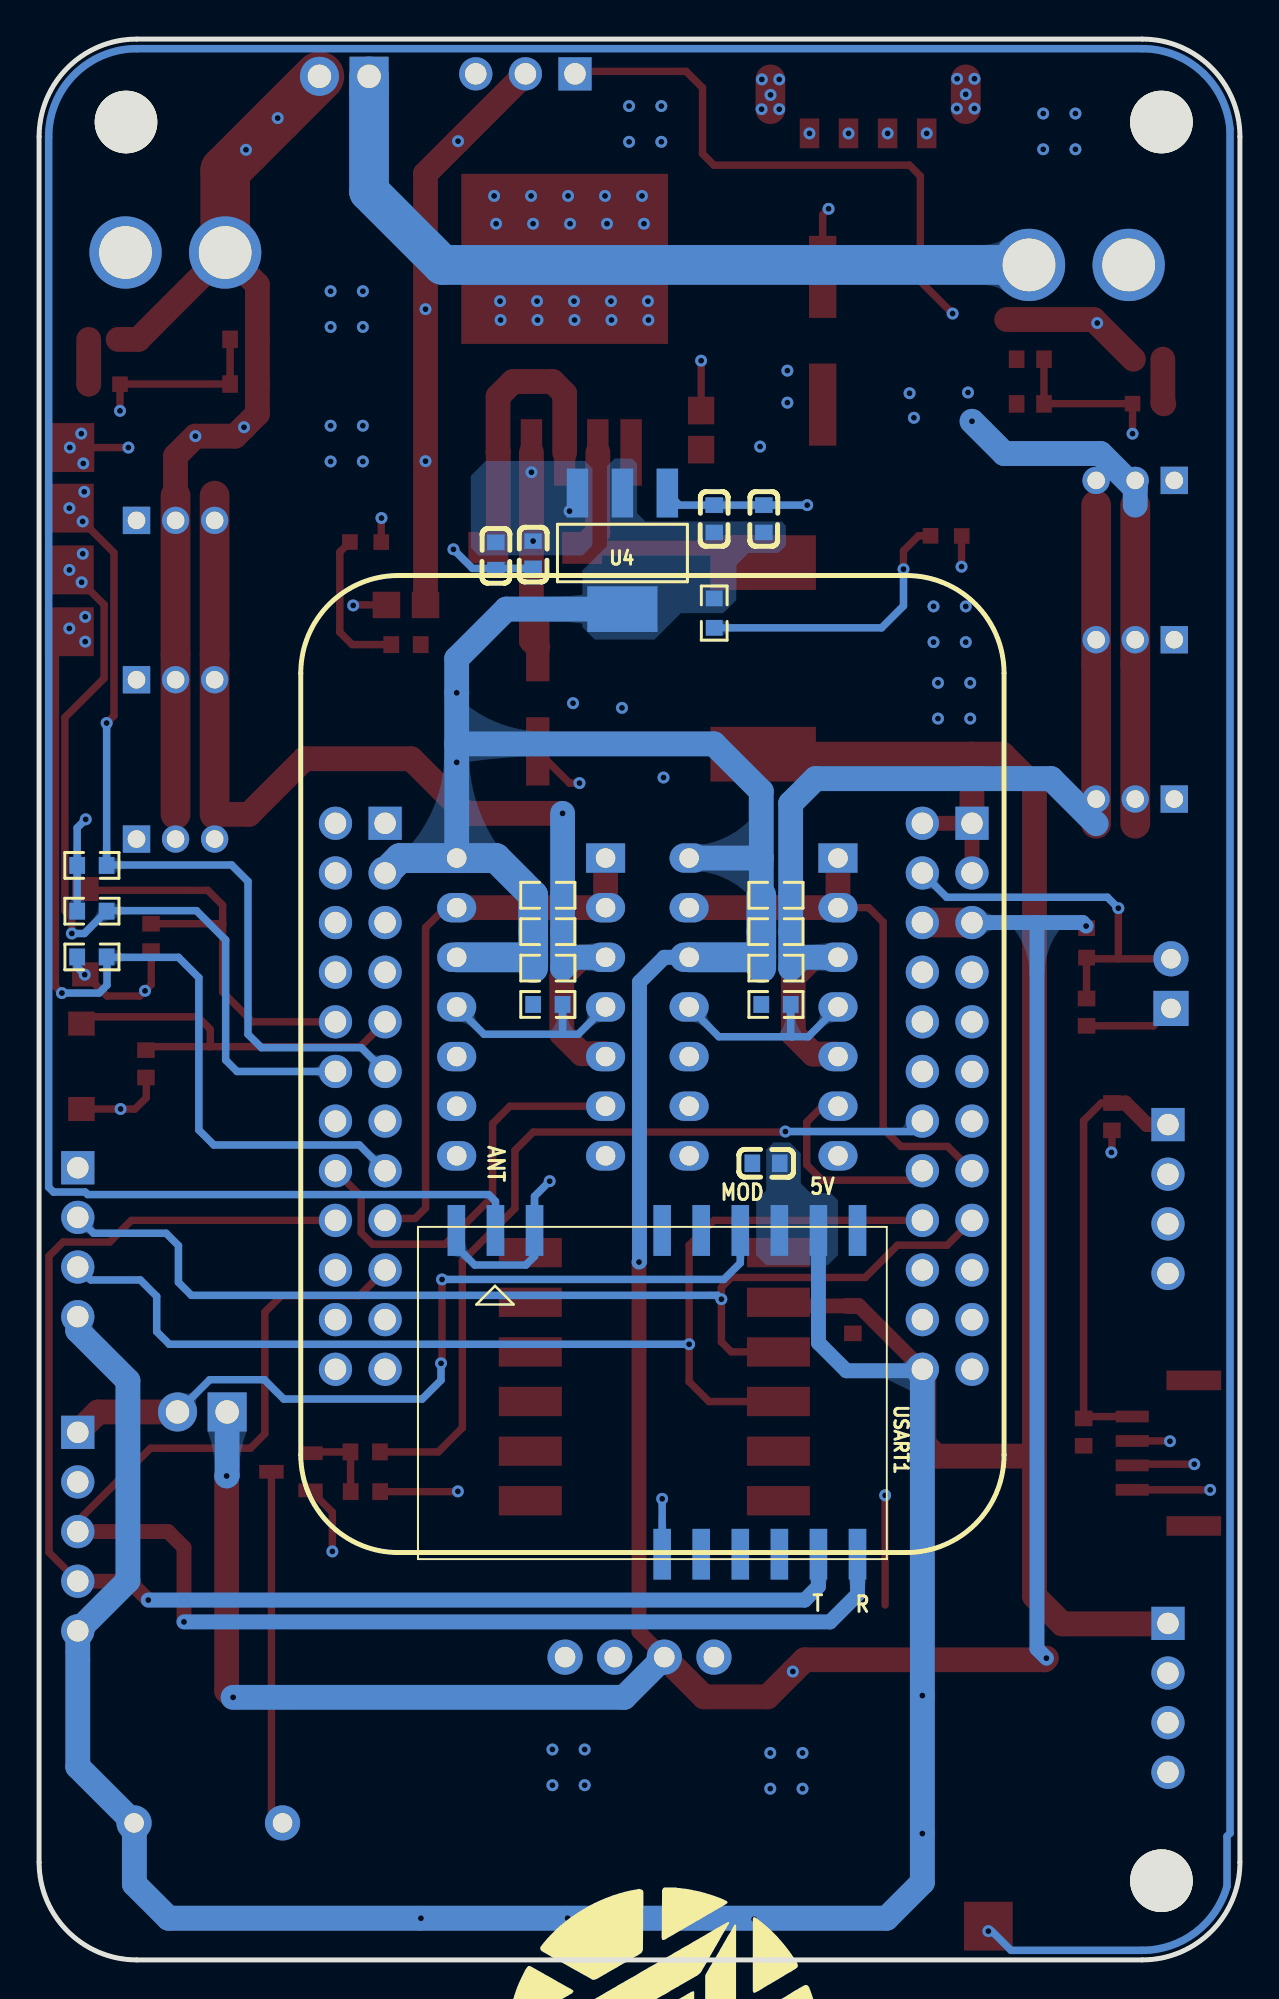
[diagram p2: board, bottom side, seen from below]

Outline 61.47 x 98.3 mm; copper layers: Top Layer, Inner1, GND, Bottom Layer. Coordinates in mm from the lower left corner of the outline.
Outline path: 0,93.3 0,5 arc(1.46,1.46) 5,0 56.47,0 arc(60,1.46) 61.47,5 61.47,93.3 arc(60,96.83) 56.47,98.3 5,98.3 arc(1.46,96.83) 0,93.3
Stack: Top Layer 0.035mm 外层铜厚1oz / Dielectric1 0.2104mm 7628 RC49% 8.6mil / Inner1 0.0152mm 内层铜厚 / Dielectric2 1.065mm 1.1mm H/HOZ 含铜 / GND 0.0152mm 内层铜厚 / Dielectric3 0.2104mm 7628 RC49% 8.6mil / Bottom Layer 0.035mm 外层铜厚1oz

## Design rules (mm)
template: JLCPCB Capability(Two Layers Board)
spacing copperThickness1oz (default): track to track 0.102, other pairs 0.152 to 0.3
spacing copperThickness2oz: track to track 0.203, other pairs 0.152 to 0.3
track width copperThickness1oz (default): min 0.127, default 0.254, max 2.54
track width copperThickness2oz: min 0.203, default 0.254, max 2.54
differential pair differentialPair (default): width min 0.127, default 0.254, max 2.54; gap min 0.152, default 0.152
via viaSize (default): diameter min 0.5, default 0.61, max 10; hole min 0.3, default 0.305, max 6.3

## Placement (name value [footprint] x y rotation side)
BUZZER1  2.7kHz  [BUZ-TH_BD12.0-P7.60-D0.6-FD]  52.81 7.01 180 top
C23  220uF  [CAP-SMD_BD6.3-L6.6-W6.6-FD]  35.94 64.52 270 top
C24  100nF  [C0805]  42.69 69.34 0 top
C25  470uF  [CAP-SMD_BD8.0-L8.3-W8.3-FD]  21.36 82.86 90 top
C26  100nF  [C0603]  36.18 71.91 270 bottom
C28  100nF  [C0603]  26.91 73.75 90 bottom
C48  10uF  [C0603]  38.09 71.84 270 bottom
C49  10uF  [C0603]  24.37 73.75 90 bottom
C50  100nF  [C0603]  7.85 48.5 90 top
C51  22uF  [C0603]  10.73 81.91 0 top
C52  100nF  [C0603]  10.73 79.63 0 top
C53  22uF  [C0603]  50.99 82.93 180 top
C54  100nF  [C0603]  50.99 80.64 180 top
C55  100nF  [C0603]  55.74 52.33 270 top
C56  100nF  [C0603]  56 45.86 270 top
C57  100nF  [C0805]  27.58 78.29 270 top
C58  100nF  [C0603]  19.81 32.77 270 top
C59  100nF  [C0603]  24.26 40.77 0 bottom
C60  100nF  [C0603]  6.55 43.15 270 top
C61  100nF  [C0603]  8 27.01 270 top
CN5  B03B-PASK-1(LF)(SN)  [conn-th_b03b-pask-1-lf-sn-1]  5.36 66.3 180 top
CN6  B03B-PASK-1(LF)(SN)  [conn-th_b03b-pask-1-lf-sn-1]  5.36 58.14 180 top
CN7  XT30UPB-F30.G.Y  [CONN-TH_XT30UPB-F]  8.25 86.74 180 top
CN8  XT30UPB-F30.G.Y  [CONN-TH_XT30UPB-F]  54.49 87.38 0 top
CN9  B03B-PASK-1(LF)(SN)  [conn-th_b03b-pask-1-lf-sn-1]  5.36 74.45 180 top
CN10  B03B-PASK-1(LF)(SN)  [conn-th_b03b-pask-1-lf-sn-1]  54.48 58.62 0 top
CN11  B03B-PASK-1(LF)(SN)  [conn-th_b03b-pask-1-lf-sn-1]  54.48 66.78 0 top
CN12  B03B-PASK-1(LF)(SN)  [conn-th_b03b-pask-1-lf-sn-1]  54.48 74.93 0 top
D2  SS54  [SMA_L4.3-W2.6-LS5.0-RD]  36.07 72.26 0 top
H6  PZ254V-12-24P  [HDR-TH_24P-P2.54-V-M-R2-C12-S2.54]  14.99 44.2 270 top
H7  USART3  [HDR-TH_4P-P2.54-V-M]  3.68 38.94 270 top
H8  PZ254V-11-03P  [HDR-TH_3P-P2.54-V-M]  36.58 96.52 0 top
H55  HC-PZ254-11.5L-1x4PZ  [HDR-TH_4P-P2.54-V-M]  3.68 13.41 270 top
H56  KH-2.54PH180-1X5P-L11.5  [HDR-TH_5P-P2.54-V-M]  59.49 21.92 270 top
H57  PZ254V-11-02P  [HDR-TH_2P-P2.54-V-M]  53.11 28.04 0 top
H58  PZ254V-12-24P  [HDR-TH_24P-P2.54-V-M-R2-C12-S2.54]  45.03 44.2 270 top
H59  PZ254V-11-02P  [HDR-TH_2P-P2.54-V-M]  45.85 96.39 0 top
H60  PZ254V-11-04P  [HDR-TH_4P-P2.54-V-M]  59.49 36.73 270 top
H62  HC-PZ254-13.8L-1x2PWA  [HDR-TH_2P-P2.54-V-M-1]  3.53 49.96 90 top
L3  33uH  [IND-SMD_L12.0-W12.0]  24.41 66.6 270 top
LED1  XL-1608SURC-06  [LED0603-RD_RED]  15.04 72.87 0 top
LED2  -  [LED_0603]  44.81 72.57 0 top
LED3  XL-1608SURC-06  [LED0603-RD_RED]  4.7 79.64 180 top
LED4  XL-1608SURC-06  [LED0603-RD_RED]  58.13 80.64 0 top
NOREF  -  [Pad_e993]  12.88 1.73 180 top
NOREF#2  -  [Pad_e100]  59.92 67.97 0 top
NOREF#3  -  [Pad_e101]  59.92 71.13 0 top
NOREF#4  -  [Pad_e1483]  59.89 77.39 0 top
NOREF#5  -  [Pad_e102]  59.92 74.3 0 top
R6  510Ω  [R0603]  26.91 68.92 270 bottom
R10  510Ω  [R0603]  42.69 67.31 0 top
R13  10kΩ  [R0603]  44.76 23.96 0 top
R14  510Ω  [R0603]  58.76 53.67 0 bottom
R15  10kΩ  [R0603]  7.85 52.04 90 top
R24  1kΩ  [R0603]  23.75 48.89 180 bottom
R25  1kΩ  [R0603]  23.75 54.48 180 bottom
R26  1kΩ  [R0603]  23.75 50.76 180 bottom
R27  1kΩ  [R0603]  23.75 52.62 180 bottom
R28  1kΩ  [R0603]  35.42 48.89 180 bottom
R29  1kΩ  [R0603]  35.42 50.76 180 bottom
R30  1kΩ  [R0603]  35.42 54.48 180 bottom
R31  1kΩ  [R0603]  35.42 52.62 180 bottom
R34  510Ω  [R0603]  58.76 56.01 0 bottom
R35  510Ω  [R0603]  58.76 51.33 0 bottom
R36  4.7kΩ  [R0603]  44.77 26 0 top
R37  2kΩ  [R0603]  4.7 81.91 180 top
R38  2kΩ  [R0603]  58.17 82.93 180 top
SCREW1  -  [M3螺丝]  4.08 3.99 0 top
SCREW3  -  [M3螺丝]  4.08 93.99 0 top
SCREW4  -  [M3螺丝]  57.08 93.99 0 top
SW1  TS-1088-AR02016  [SW-SMD_L3.9-W3.0-P4.45]  59.1 52.62 270 top
SW2  TS-1088-AR02016  [SW-SMD_L3.9-W3.0-P4.45]  59.3 45.73 270 top
U2  -  [JY901s]  29.97 29.84 0 top
U4  AMS1117-3.3  [SOT-223-3_L6.5-W3.4-P2.30-LS7.0-BR]  31.61 72.1 90 bottom
U6  SS8050  [SOT-23-3_L2.9-W1.3-P1.90-LS2.4-BR]  48.57 24.98 180 top
U8  LM2596S-5.0/TR  [TO-263-5_L10.2-W8.6-P1.70-LS14.4-TL]  34.57 82.1 90 top
U19  SN74HC125N  [PDIP-14_L19.3-W6.4-P2.54-LS7.6-BL]  24.38 48.77 270 top
U20  I2C1  [OLED-TH_L27.8-W27.2-P2.54_C9900033791]  30.73 15.49 0 top
U21  SN74HC125N  [PDIP-14_L19.3-W6.4-P2.54-LS7.6-BL]  36.28 48.77 270 top
U25  -  [四PinU型按键]  18.03 93.47 0 top
U27  WAFER-GH1.25-4PWB  [CONN-SMD_4P-P1.25_XUNPU_WAFER-GH1.25-4PWB]  3.94 25.93 270 top
USART1  -  [atk-lora]  28.58 29.34 0 bottom

## Footprints (pads in the part's own frame, mm; a bottom-side part is the same pattern mirrored in y, then rotated)
atk-lora
  rect 0.9x2.6 smd: 1(11.532,-7.992) 2(9.532,-7.992) 3(7.532,-7.992) 4(0.999,-7.992) 5(-1.001,-7.992) 6(-3.001,-7.992) 7(-5.001,-7.992) 8(-7.001,-7.992) 9(-9.001,-7.992) 10(-9.001,8.576) 11(-7.001,8.576) 12(-5.001,8.576) 13(-3.001,8.576) 14(-1.001,8.576) 15(0.999,8.576)
BUZ-TH_BD12.0-P7.60-D0.6-FD
  round 1.8 hole 1: 1(-3.8,0) 2(3.8,0)
C0603
  rect 0.8x0.9 smd: 1(-0.7,0) 2(0.7,0)
C0805
  rect 1.41x1.35 smd: 1(-1,0) 2(1,0)
CAP-SMD_BD6.3-L6.6-W6.6-FD
  rect 3.5x1.2 smd: 1(-2.67,0) 2(2.67,0)
CAP-SMD_BD8.0-L8.3-W8.3-FD
  rect 4.2x1.4 smd: 1(-3.267,0) 2(3.267,0)
CONN-SMD_4P-P1.25_XUNPU_WAFER-GH1.25-4PWB
  rect 0.6x1.7 smd: 1(-1.875,1.575) 2(-0.625,1.575) 3(0.625,1.575) 4(1.875,1.575)
  rect 1x2.8 smd: 5(3.725,-1.575) 6(-3.725,-1.575)
conn-th_b03b-pask-1-lf-sn-1
  rect 1.4x1.4 hole 0.9: 1(1.998,-1.263)
  round 1.4 hole 0.9: 2(-0.002,-1.263) 3(-2.002,-1.263)
CONN-TH_XT30UPB-F
  round 3.7 hole 2.7: 1(-2.55,0) 2(2.55,0)
HDR-TH_2P-P2.54-V-M
  rect 2x2 hole 1.2: 1(-1.27,0)
  round 2 hole 1.2: 2(1.27,0)
HDR-TH_2P-P2.54-V-M-1
  rect 1.8x1.8 hole 1: 1(-1.27,0)
  round 1.8 hole 1: 2(1.27,0)
HDR-TH_3P-P2.54-V-M
  rect 1.7x1.7 hole 1.1: 1(-2.54,0)
  round 1.7 hole 1.1: 2(0,0) 3(2.54,0)
HDR-TH_4P-P2.54-V-M
  rect 1.7x1.7 hole 1.1: 1(-3.81,0)
  round 1.7 hole 1.1: 2(-1.27,0) 3(1.27,0) 4(3.81,0)
HDR-TH_5P-P2.54-V-M
  rect 1.7x1.7 hole 1.1: 1(-5.08,0)
  round 1.7 hole 1.1: 2(-2.54,0) 3(0,0) 4(2.54,0) 5(5.08,0)
HDR-TH_24P-P2.54-V-M-R2-C12-S2.54
  rect 1.7x1.7 hole 1.1: 1(-13.97,-1.27)
  round 1.7 hole 1.1: 2(-13.97,1.27) 3(-11.43,-1.27) 4(-11.43,1.27) 5(-8.89,-1.27) 6(-8.89,1.27) 7(-6.35,-1.27) 8(-6.35,1.27) 9(-3.81,-1.27) 10(-3.81,1.27) 11(-1.27,-1.27) 12(-1.27,1.27) 13(1.27,-1.27) 14(1.27,1.27) 15(3.81,-1.27) 16(3.81,1.27) 17(6.35,-1.27) 18(6.35,1.27) 19(8.89,-1.27) 20(8.89,1.27) 21(11.43,-1.27) 22(11.43,1.27) 23(13.97,-1.27) 24(13.97,1.27)
IND-SMD_L12.0-W12.0
  rect 2.8x5.4 smd: 1(4.9,0) 2(-4.9,0)
JY901s
  rect 3.224x1.501 smd: 1(-6.35,6.35) 2(-6.35,3.81) 3(-6.35,1.27) 4(-6.35,-1.27) 5(-6.35,-3.81) 6(-6.35,-6.35) 7(6.35,-6.35) 8(6.35,-3.81) 9(6.35,-1.27) 10(6.35,1.27) 11(6.35,3.81) 12(6.35,6.35)
LED0603-RD_RED
  rect 0.8x0.8 smd: 1(-0.799,-0.004) 2(0.799,0.004)
LED_0603
  rect 0.8x0.8 smd: 1(-0.851,-0.01) 2(0.75,-0.005)
M3螺丝
  round 3.2 hole 3.2: 1(-0.064,0.064)
OLED-TH_L27.8-W27.2-P2.54_C9900033791
  round 1.8 hole 1.05: 1(-3.81,0) 2(-1.27,0) 3(1.27,0) 4(3.81,0)
Pad_e100
  rect 2.5x2.5 smd: 3(0,0)
Pad_e101
  rect 2.5x2.5 smd: 3(0,0)
Pad_e102
  rect 2.5x2.5 smd: 3(0,0)
Pad_e993
  rect 2.5x2.5 smd: 3(0,0)
Pad_e1483
  rect 2.5x2.5 smd: 3(0,0)
PDIP-14_L19.3-W6.4-P2.54-LS7.6-BL
  rect 1.5x2 hole 1: 1(-7.62,-3.81)
  oval 1.5x2 hole 1: 2(-5.08,-3.81) 3(-2.54,-3.81) 4(0,-3.81) 5(2.54,-3.81) 6(5.08,-3.81) 7(7.62,-3.81) 8(7.62,3.81) 9(5.08,3.81) 10(2.54,3.81) 11(0,3.81) 12(-2.54,3.81) 13(-5.08,3.81) 14(-7.62,3.81)
R0603
  rect 0.806x0.864 smd: 1(-0.753,0) 2(0.753,0)
SMA_L4.3-W2.6-LS5.0-RD
  rect 2.046x1.62 smd: 1(-2.404,-0.009) 2(2.404,0.009)
SOT-23-3_L2.9-W1.3-P1.90-LS2.4-BR
  rect 1.25x0.7 smd: 1(1,-0.95) 2(1,0.95) 3(-1,0)
SOT-223-3_L6.5-W3.4-P2.30-LS7.0-BR
  rect 2.5x1.1 smd: 1(2.97,-2.3) 2(2.97,0) 3(2.97,2.3)
  rect 2.34x3.6 smd: 4(-2.97,0)
SW-SMD_L3.9-W3.0-P4.45
  rect 1.23x1.36 smd: 1(-2.185,0) 2(2.185,0)
TO-263-5_L10.2-W8.6-P1.70-LS14.4-TL
  rect 3.4x1.1 smd: 1(-4.953,3.4) 2(-4.953,1.7) 3(-4.953,0) 4(-4.953,-1.7) 5(-4.953,-3.4)
  rect 8.705x10.587 smd: 6(4.953,0)
四PinU型按键
  rect 1x1.524 smd: 1(-2,0) 2(0,0) 3(2,0) 4(4,0)
  oval 1.524x3.048 smd: 5(-4,2) 6(6,2)

## Nets
As in the schematic, except:
5V: BUZZER1.1 C23.1 C24.1 C26.1 C48.1 C58.1 C59.1 H6.1 H6.2 H6.3 H6.24 H8.2 H55.1 H56.5 H60.4 L3.1 R10.1 U2.2 U4.3 U8.4 USART1.7 USART1.8
GND: C23.2 C24.2 C25.2 C26.2 C28.2 C48.2 C49.2 C50.1 C51.1 C52.1 C53.1 C54.1 C55.2 C56.2 C57.1 C58.2 C59.2 C60.2 C61.2 CN5.1 CN6.1 CN7.2 CN8.2 CN9.1 CN10.1 CN11.1 CN12.1 H6.7 H6.8 H6.9 H6.10 H7.2 H8.3 H55.4 H56.2 H58.5 H58.6 H58.24 H60.1 H62.1 LED1.1 LED2.1 LED3.1 LED4.1 NOREF#4.3 R13.1 R14.2 R24.1 R28.1 R34.2 R35.2 SW1.2 SW2.2 U2.5 U4.1 U6.2 U8.6 U19.7 U20.1 U21.7 U25.2 U27.2 USART1.1 USART1.3 USART1.9 USART1.15
ANT: NOREF.3 USART1.2
PA2: H6.17 H60.2 U2.3
PA3: H6.18 H60.3 U2.4
PB5: H58.15 NOREF#2.3 R35.1
PB8: H58.12 NOREF#3.3 R14.1
PB9: H58.11 NOREF#5.3 R34.1

Pads without a net: SCREW1 1; SCREW3 1; SCREW4 1; U2 1 6 7 8 9 10 11 12; U19 8 9 10; U21 8 9 10; U25 5 6; U27 5 6; USART1 4 5 12 13 14

## Via types
v1: diameter 0.61, hole 0.305, Top Layer to Bottom Layer, 151 vias

## Routing (per net, layer and track width the routed paths; a pad name or vN(x,y) marks a point on that pad's centre or on a via; arc(x,y) is an arc through that point)
3V3: length 212.5
  Top Layer w0.762: v1(30.76,35.71) 30.76,16.79 U20.2
  Top Layer w1.27: v1(9.91,15.44) 9.99,15.36 22.28,15.36 v1(22.88,14.76) 24.18,13.46 27.43,13.46 U20.2 ; v1(51.87,24.77) 51.87,13.77 v1(51.54,13.44)
  Top Layer w1.524: H6.5 H6.6
  Bottom Layer w0.762: v1(30.76,35.71) 30.73,35.74 30.73,50.04 29.46,51.31 U19.12 ; 10.47,53.09 8.05,53.09 v1(7.87,52.91) ; 10.47,53.09 H6.5 ; 10.47,53.09 10.39,53.01 10.39,15.93 v1(9.91,15.44)
  Bottom Layer w1.27: v1(51.87,24.77) 51.84,24.79 H57.1 ; R25.1 24.5,56.38 ; 24.5,56.38 24.51,56.39 U19.14 ; 24.5,56.38 24.5,59.81 26.92,62.23 39.71,62.23 39.74,62.2 40.09,62.2 ; U21.14 v1(40.09,61.29) 40.09,62.2 ; U4.4 37.55,69.13 40.09,66.59 v1(40.09,64.84) 40.09,62.2 ; v1(51.54,13.44) 31.52,13.44 U20.2
  Bottom Layer w1.524: 36.18,51.24 R31.1 R30.1 38.08,56.39 U21.14 42.99,56.39 H58.3 ; 36.18,51.24 36.25,51.31 U21.12 ; 36.18,51.24 R29.1 ; R25.1 R27.1 24.5,51.35 ; 24.5,51.35 R26.1 ; 24.5,51.35 24.54,51.31 U19.12
5V: length 242.2
  Top Layer w0.762: U2.2 23.43,33.47 C58.1 19.5,33.47 H6.24 ; H6.2 H6.1 H6.3
  Top Layer w1.27: H6.24 16.18,30.15 16.18,26.42 15.55,25.78 10.64,25.78 10.52,25.91 ; H55.1 3.71,17.2 9.09,17.2 10.52,18.62 10.52,25.91 ; C24.1 v1(41.69,76.7) v1(41.69,84.48) 41.69,91.41 v1(40.02,93.07) H8.2 ; 10.52,25.91 10.52,60.07 12.15,61.7 13.76,61.7 ; U8.4 v1(36.27,76.13) 36.27,67.51 C23.1 ; L3.1 13.76,61.7 ; 13.76,61.7 13.72,61.67 H6.1
  Bottom Layer w0.762: USART1.8 21.57,31.58 20.14,30.15 16.33,30.15 H6.24
  Bottom Layer w1.27: H60.4 59.49,32.21 56.92,29.64 56.92,19.41 H56.5 59.49,9.89 BUZZER1.1 56.59,7 56.59,3.89 54.84,2.13 v1(41.92,2.13) v1(34.41,2.13) 18.08,2.13 16.26,3.96 v1(16.26,6.47) v1(16.26,13.53) H6.24
  vias: v1(24.87,2.08) v1(29.51,60.51) v1(31.63,64.07) v1(34.14,64.31) v1(34.32,74.14) v1(36.18,72.61)
12V1: length 75.5
  Top Layer w1.27: R37.1 7.48,83.95 11.94,83.95
  Top Layer w1.524: 5.36,58.14 5.36,74.45
  Bottom Layer w1.27: 5.36,74.45 5.36,75.31 7.14,77.09 12.06,77.09 v1(13.72,78.74)
  Bottom Layer w2.032: H59.1 44.58,90.5 40.82,86.74 CN7.1
  vias: v1(7.31,83.77) v1(13.92,80.21) v1(16.69,78.92) v1(16.91,80.18) v1(23.17,81.33) v1(23.17,79.69) v1(24.56,77.44)
12V2: length 50.7
  Top Layer w1.27: 54.48,74.93 54.48,76.96 v1(53.47,77.98) 51.44,77.98 v1(50.98,78.44) 50.29,79.12 C54.2 C53.2 50.29,85.72 CN8.1 56.39,82.93 57.42,82.93
  Top Layer w1.524: 54.48,58.62 54.48,74.93
  Top Layer w2.54: CN8.1 51.94,91.57 v1(50.88,92.63) v1(49.25,94.26) H59.2
GND: length 90.2
  Top Layer w0.381: v1(57.33,79.27) LED4.1 57.31,80.64 C54.1 C53.1 ; C57.1 v1(27.58,81.84) ; v1(40.03,23.98) 40.04,23.96 44.01,23.96 ; v1(43.94,73.79) 43.95,73.77 LED2.1 ; v1(33.81,60.22) 34.32,60.22 C23.2 ; C55.2 55.73,51.62 55.73,49.91 v1(56.05,49.59) 56.31,49.33 57.99,49.33 SW1.2 59.12,50.42 v1(59.13,50.42) ; C24.2 45.36,69.34 v1(45.39,69.32) ; C60.2 6.55,41.35 v1(6.58,41.33) ; U27.2 3.6,26.56 v1(3.58,26.54) ; v1(59.89,77.39) v1(56.9,77.39) ; C50.1 4.42,47.8 H62.1 ; v1(21.06,89.61) 21.36,89.31 C25.2 ; v1(5.5,78.11) LED3.1 10.02,79.64 C52.1 C51.1 ; C56.2 55.98,45.14 55.98,44.12 56.56,43.55 v1(57.3,43.55) SW2.2 ; v1(14.25,71.3) 14.25,72.86 14.24,72.87 ; U6.2 46.46,22.91 v1(46.46,20.9)
  Bottom Layer w0.381: USART1.1 40.11,36.5 39.17,35.56 36.55,35.56 36.11,36 USART1.3 36.11,39.08 v1(35.33,39.85) ; R14.2 R34.2 59.52,57.93 v1(59.08,58.37) ; C26.2 39.28,71.21 v1(40.26,72.19) ; U4.1 28.69,74.45 C28.2 C49.2 v1(22.15,74.45) ; v1(59.13,50.42) 59.52,50.8 R35.2 ; USART1.15 v1(29.57,23.6)
  vias: v1(8.42,94.49) v1(8.42,92.66) v1(10.07,94.49) v1(10.07,92.66) v1(13.81,65.35) v1(13.81,63.53) v1(14.03,69.27) v1(14.03,67.44) v1(15.46,65.35) v1(15.46,63.53) v1(15.68,69.27) v1(15.68,67.44) v1(18.03,93.47) v1(22.39,10.59) v1(22.39,8.76) v1(24.04,10.59) v1(24.04,8.76) v1(29.62,94.87) v1(29.62,93.04) v1(30.3,84.89) v1(30.28,83.92) v1(30.51,88.85) v1(30.61,90.27) v1(31.27,94.87) v1(31.27,93.04) v1(32.19,84.89) v1(32.17,83.92) v1(32.4,88.85) v1(32.5,90.27) v1(33.54,10.77) v1(33.54,8.94) v1(34.09,84.89) v1(34.06,83.92) v1(34.29,88.85) v1(34.39,90.27) v1(35.19,10.77) v1(35.19,8.94) v1(35.98,84.89) v1(35.95,83.92) v1(36.18,88.85) v1(36.28,90.27) v1(37.85,83.92) v1(37.87,84.89) v1(38.07,88.85) v1(38.18,90.27) v1(44.89,85.39) v1(44.89,83.57) v1(44.89,78.51) v1(44.89,76.68) v1(46.55,85.39) v1(46.55,83.57) v1(46.55,78.51) v1(46.55,76.68) v1(59.21,76.58) v1(59.31,78.11)
VCC: length 22.9
  Top Layer w0.381: U27.1 7.9,27.81 C61.1 8,42.95 7.09,43.85 C60.1
  Top Layer w0.762: C60.1 5.87,43.85 4.76,42.75 H7.1
(no net):
  vias: v1(13.59,96.27) v1(13.59,94.74) v1(14.03,95.47) v1(14.48,96.27) v1(14.49,94.74) v1(23.58,96.23) v1(23.58,94.71) v1(24.03,95.44) v1(24.47,96.23) v1(24.49,94.71)
ANT: length 247.6
  Bottom Layer w0.381: USART1.2 38.11,38.82 38.45,39.17 58.98,39.17 59.11,39.29 60.73,39.29 60.98,39.54 60.98,93.3 arc(59.66,96.49) 56.47,97.81 5,97.81 arc(3.29,97.47) 1.84,96.52 arc(0.92,95.22) 0.51,93.68 0.51,6.48 0.66,6.32 0.66,3.77 arc(2.28,1.4) 5,0.49 11.72,0.49 12.7,1.47
  vias: v1(12.88,1.47)
BUS1: length 52.9
  Top Layer w1.27: U19.5 20.7,46.36 21.84,46.36 22.86,47.37 22.86,50.29 21.84,51.31 U19.3
  Top Layer w1.524: 7.36,58.14 7.36,74.45
  Bottom Layer w1.27: 7.36,58.14 9.67,60.45 21.73,60.45 23,59.18 R25.2 R27.2 R26.2 22.45,51.31 U19.3
BUS2: length 55.2
  Top Layer w1.27: 32.43,46.25 32.55,46.37 33.7,46.37 34.71,47.39 34.71,50.31 33.7,51.33 32.43,51.33 ; v1(34.67,58.67) 39.62,58.67 42.42,61.47 47.88,61.47 50.72,58.62 52.48,58.62
  Top Layer w1.524: 52.48,58.62 52.48,74.93
  Bottom Layer w1.27: v1(34.67,58.67) R30.2 R31.2 R29.2 34.12,51.31 U21.3
MDO: length 43
  Top Layer w0.381: v1(40.84,34.82) 40.84,30.58 v1(40.89,30.53)
  Top Layer w1.27: H57.2 58.45,28.04 H56.1
  Bottom Layer w0.381: H57.2 52.73,29.69 49.94,29.69 48.95,28.7 41.86,28.7 40.89,29.67 v1(40.89,30.53) ; 40.89,34.87 v1(40.84,34.82) 26.42,34.82 25.57,35.67 USART1.6
OE1: length 10.6
  Bottom Layer w0.381: 22.93,47.24 23,47.31 R24.2 ; 22.93,47.24 26.67,47.24 U19.11 ; 22.93,47.24 22.1,47.24 U19.4
OE2: length 10.3
  Bottom Layer w0.381: U21.4 33.87,47.37 34.69,47.37 ; 34.69,47.37 34.67,47.39 R28.2 ; 34.69,47.37 38.69,47.37 U21.11
PA0: length 28.8
  Top Layer w0.381: U19.2 19,53.85 18.26,53.11 18.26,42.55 17.35,41.63 14.96,41.63 H6.15
  Top Layer w1.27: U19.1 U19.2 U19.13
PA1: length 10.6
  Top Layer w0.381: U19.6 21.36,43.69 22.17,42.88 22.17,40.69 21.39,39.9 16.74,39.9 H6.16
PA2: length 56
  Top Layer w0.381: H6.17 14.99,36.58 17.53,36.58 19.18,34.92 26.04,34.92 26.54,34.42 v1(26.54,33.81) 26.54,31.62 26.04,31.11 U2.3
  Bottom Layer w0.381: H60.2 58.67,37.19 54.97,37.19 54.33,36.55 54.33,34.67 53.67,34.01 26.74,34.01 v1(26.54,33.81)
PA3: length 58.4
  Top Layer w0.381: U2.4 27.18,28.58 28.19,29.59 v1(28.19,31.51) 28.19,36.58 26.92,37.85 H6.18
  Bottom Layer w0.381: H60.3 58.83,34.8 56.29,34.8 55.45,33.96 55.45,32.15 54.8,31.51 v1(28.19,31.51)
PA9: length 71.9
  Top Layer w0.381: H58.19 45.08,33.98 49.07,33.98 49.91,33.15 49.91,26.92 50.65,26.19 55.76,26.19 59.49,22.46 H56.3
  Top Layer w0.762: H56.3 54.86,21.92 54.05,21.11 v1(54.05,17.3)
  Bottom Layer w0.762: USART1.10 19.57,18.7 20.98,17.3 v1(54.05,17.3)
PA10: length 72.9
  Top Layer w0.381: H58.18 56.74,37.85 57.85,36.74 60.24,36.74 60.96,36.02 60.96,20.85 H56.4
  Top Layer w0.762: v1(55.88,18.41) 56.85,19.38 H56.4
  Bottom Layer w0.762: v1(55.88,18.41) 22.28,18.41 21.57,19.12 USART1.11
PB5: length 46.2
  Top Layer w0.381: v1(60.3,49.48) 60.63,49.81 60.63,67.26 NOREF#2.3
  Bottom Layer w0.381: 57.99,51.31 R35.1 ; 57.99,51.31 54.33,51.31 53.29,50.27 53.29,42.47 52.53,41.71 45.08,41.71 H58.15 ; 57.99,51.31 57.99,49.88 58.39,49.48 v1(60.3,49.48)
  vias: v1(59.11,68.73) v1(59.11,67.46) v1(59.92,68.14)
PB6: length 43.5
  Inner1 w0.381: H58.14 47.24,42.93 48.06,42.11 48.06,19.43 46.76,18.14 32.79,18.14 32,17.35 U20.3
PB7: length 47.8
  Inner1 w0.381: U20.4 34.54,16.71 35.1,17.27 48.16,17.27 49.5,18.62 49.5,42.49 47.85,44.14 44.98,44.14 H58.13
PB8: length 41.3
  Top Layer w0.381: v1(59.92,71.13) v1(59.29,70.5) 58.14,69.35 58.14,65.58 60.15,63.58 60.15,53.69 59.79,53.34 v1(59.79,52.53)
  Bottom Layer w0.381: H58.12 51.33,45.47 51.92,46.05 51.92,52.2 53.42,53.7 57.98,53.7 R14.1 59.15,52.53 v1(59.79,52.53)
  vias: v1(59.23,71.96)
PB9: length 42.6
  Top Layer w0.381: v1(59.92,74.3) v1(59.24,73.61) 57.63,72.01 57.63,63.67 v1(58.01,63.3)
  Bottom Layer w0.381: H58.11 44.98,46.69 50.09,46.69 50.77,47.37 50.77,55.19 51.61,56.03 57.99,56.03 R34.1 v1(58.01,63.3)
  vias: v1(59.16,75.13)
PC1: length 41.5
  Top Layer w0.381: v1(23.27,42.39) 23.29,42.37 36.17,42.37 37.11,41.43 37.11,38.46 39.8,35.76 39.8,27.23 41.03,26 R36.1
  Bottom Layer w0.381: v1(23.27,42.39) 16.79,42.39 H6.14
PC6: length 57
  Inner1 w0.381: H55.3 12.8,12.14 14.05,13.39 14.05,16.81 15.7,18.47 28.3,18.47 28.91,19.08 28.91,19.96 29.59,20.65 41.71,20.65 42.44,21.39 42.44,31.45 H58.21
PC7: length 72.8
  Inner1 w0.381: 13.08,19.43 6.81,19.43 6.12,20.12 6.12,22.23 5.13,23.22 3.02,23.22 3,23.24 ; 13.08,19.43 11.79,18.14 11.79,15.77 10.44,14.43 3.94,14.43 H55.2 ; 13.08,19.43 28.02,19.43 28.3,19.71 28.3,20.8 28.91,21.41 40.97,21.41 41.71,22.15 41.71,33.27 42.52,34.09 45.08,34.09 H58.20
PC12: length 28.9
  Top Layer w0.381: U21.13 40.67,53.85 41.68,52.83 41.68,38.48 42.21,37.95 43.65,37.95 H58.17
  Top Layer w1.27: U21.13 U21.2 U21.1
PD2: length 21.6
  Top Layer w0.381: H58.16 44.98,39.07 44.98,37.21 44.4,36.63 40.69,36.63 38.25,39.06 38.25,42.8 37.36,43.69 U21.6
PD8: length 95.7
  Top Layer w0.381: U27.3 5.45,25.37 v1(2.34,25.37)
  Inner1 w0.381: H58.23 43.76,20.72 42.77,19.74 30.43,19.74 29.85,19.15 29.85,18.11 29.46,17.73 17.04,17.73 15.19,15.88 15.19,9.5 13.79,8.1 3.02,8.1 2.34,8.79 v1(2.34,25.37) 2.34,32.49 3.04,33.19 4.31,33.19 4.98,33.86 4.98,37.08 4.39,37.67 H7.3
PD9: length 101.7
  Top Layer w0.381: U27.4 5.51,24.05 v1(1.52,24.05)
  Inner1 w0.381: H7.4 3.51,34.95 2.11,34.95 1.52,34.37 v1(1.52,24.05) 0.51,23.04 0.51,7.98 1.4,7.09 15.9,7.09 17.48,8.66 17.48,15.54 18.74,16.81 30.51,16.81 30.94,17.25 30.94,18.21 31.62,18.9 44.48,18.9 45.06,19.48 45.06,31.53 H58.22
PE0: length 21.9
  Top Layer w0.381: H58.10 50.55,48.01 52.07,49.53 52.07,53.03 ; 52.07,53.03 52.07,53.97 52.83,54.74 59.03,54.74 SW1.1 ; 52.07,53.03 C55.1
PE1: length 20.7
  Top Layer w0.381: H58.9 45.03,46.74 52.74,46.74 ; C56.1 55.82,46.74 52.74,46.74 ; 52.74,46.74 52.7,46.77 52.7,47.62 53.34,48.26 58.95,48.26 SW2.1
PE2: length 60.2
  Inner1 w0.381: v1(22.03,93.47) 22.05,93.46 22.05,82.58 20.5,81.03 11.63,81.03 10.82,80.21 10.82,46.33 11.68,45.47 H6.11
PE3: length 64.1
  Inner1 w0.381: H6.12 15.06,44.27 11.02,44.27 10.11,45.19 10.11,81.18 11.2,82.27 19.2,82.27 20.02,83.08 20.02,93.45 v1(20.03,93.47)
PE4: length 59.7
  Inner1 w0.381: v1(16.03,93.47) 16.08,93.43 16.08,84.33 15.27,83.52 10.64,83.52 9.47,82.35 9.47,43.94 10.49,42.93 H6.13
PE9: length 92.4
  Top Layer w0.381: v1(14.71,84.25) 16.36,85.9 16.36,91.29 16.92,91.85 26.92,91.85 27.51,92.43 27.51,95.81 28.35,96.65 33.91,96.65 H8.1
  Inner1 w0.381: v1(14.71,84.25) 9.98,84.25 8.74,83.01 8.74,35.25 9.88,34.11 14.91,34.11 H6.22
RST: length 58.6
  Top Layer w0.381: C50.2 7.85,51.29 R15.1 7.79,51.23 6.22,51.23 ; 18.16,18.16 v1(18.16,23.77) ; H62.2 6.22,51.23 ; 6.22,51.23 6.22,51.24 v1(6.22,53.82)
  Inner1 w0.381: H6.4 17.2,55.63 18.16,54.66 v1(18.16,23.77)
  Bottom Layer w0.381: v1(6.22,53.82) 6.78,54.38 15.01,54.38 H6.4
$1N4130: length 14.7
  Top Layer w0.381: v1(17.22,71.17) 17.22,72.11 16.46,72.88 LED1.2
  Bottom Layer w0.381: R6.2 18.34,68.17 17.22,69.29 v1(17.22,71.17)
$1N4134: length 4.1
  Top Layer w0.381: R13.2 45.53,23.97 R36.2 47.51,26 U6.1
$1N4137: length 18.2
  Top Layer w0.381: BUZZER1.2 49.57,7.58 U6.3
$1N4153: length 2.3
  Top Layer w1.27: LED3.2 3.95,79.68 R37.2
$1N4155: length 2.3
  Top Layer w1.27: LED4.2 58.93,80.64 R38.1
$1N14491: length 14.9
  Top Layer w1.27: U8.3 34.57,80.16 35.18,80.77 37.21,80.77 37.97,80.01 37.97,77.15 U8.5 37.97,72.78 D2.2
$1N14492: length 14.8
  Top Layer w0.762: L3.2 25.15,72.25 D2.1
  Top Layer w1.27: 32.86,77.15 32.86,73.05 D2.1
$1N14499: length 7.7
  Top Layer w0.381: R10.2 45.44,67.31 46.08,67.94 46.08,72.04 LED2.2

## Copper pours and planes (outline as drawn; the poured copper is in the pictures)
3V3 on Top Layer: 41.91,60.58 47.75,60.58 47.75,54.36 41.91,54.36
3V3 on Bottom Layer: 23.24,76.83 33.69,76.83 33.69,67.56 23.24,67.56
5V on Top Layer: 20.57,70.61 42.69,70.61 42.69,59.18 20.57,59.18
5V on Bottom Layer: 20.57,41.84 24.77,41.84 24.77,35.56 20.57,35.56
5V on Bottom Layer: 33.15,76.71 39.37,76.71 39.37,71.88 33.15,71.88
12V1 on Top Layer: 8.64,89.15 31.88,89.15 31.88,75.18 8.64,75.18
GND on Top Layer: -10.34,110.19 71.53,110.19 71.53,-12.75 -10.34,-12.75
GND on Bottom Layer: -6.66,104.8 61.34,104.8 61.34,-2.01 -6.66,-2.01
GND on Inner1: -23.22,131.67 91.52,131.67 91.52,-38.56 -23.22,-38.56
GND on GND: -16.13,120.34 81.61,120.34 81.61,-27.81 -16.13,-27.81

Small or netless copper shapes (teardrops, artwork), in the pictures only: 163 on Top Layer, 88 on Bottom Layer, 28 on Inner1

## Text on the board
Bottom Silkscreen Layer: ANT | R | T | 5V | MOD
Top Silkscreen Layer: + / - / T / R | G / PB9 / PB8 / PB5 | 5V | 3V3 | + | - | PE0 | PE1 | S | MOD调试 | M | R | T | 电桥 | 陀螺仪 | 射频 | DJi | U6 | ANT | RESET | 笨笨三代V1.0 / 2025/2/15 / Designed By Point | U4 | 后 | 前 | U5
